# EasyEDA Pro project ProProject_Spherical_Robot_RC_V2.0_2024-05-04.epro

# Schematic Spherical_Robot_RC_V2.0

## Sheets
1 充电马达音频: Create Date: 2023-10-21; Page Name: 充电马达音频; Project Name: Spherical_Robot_RC_V2.0; Schematic Name: Spherical_Robot_RC_V2.0; Update Date: 2023-11-07; Company: 西安交通大学; Drawed: Daemon.Chen; Page Size: A4; Reviewed: Daemon.Chen; Version: V2.0
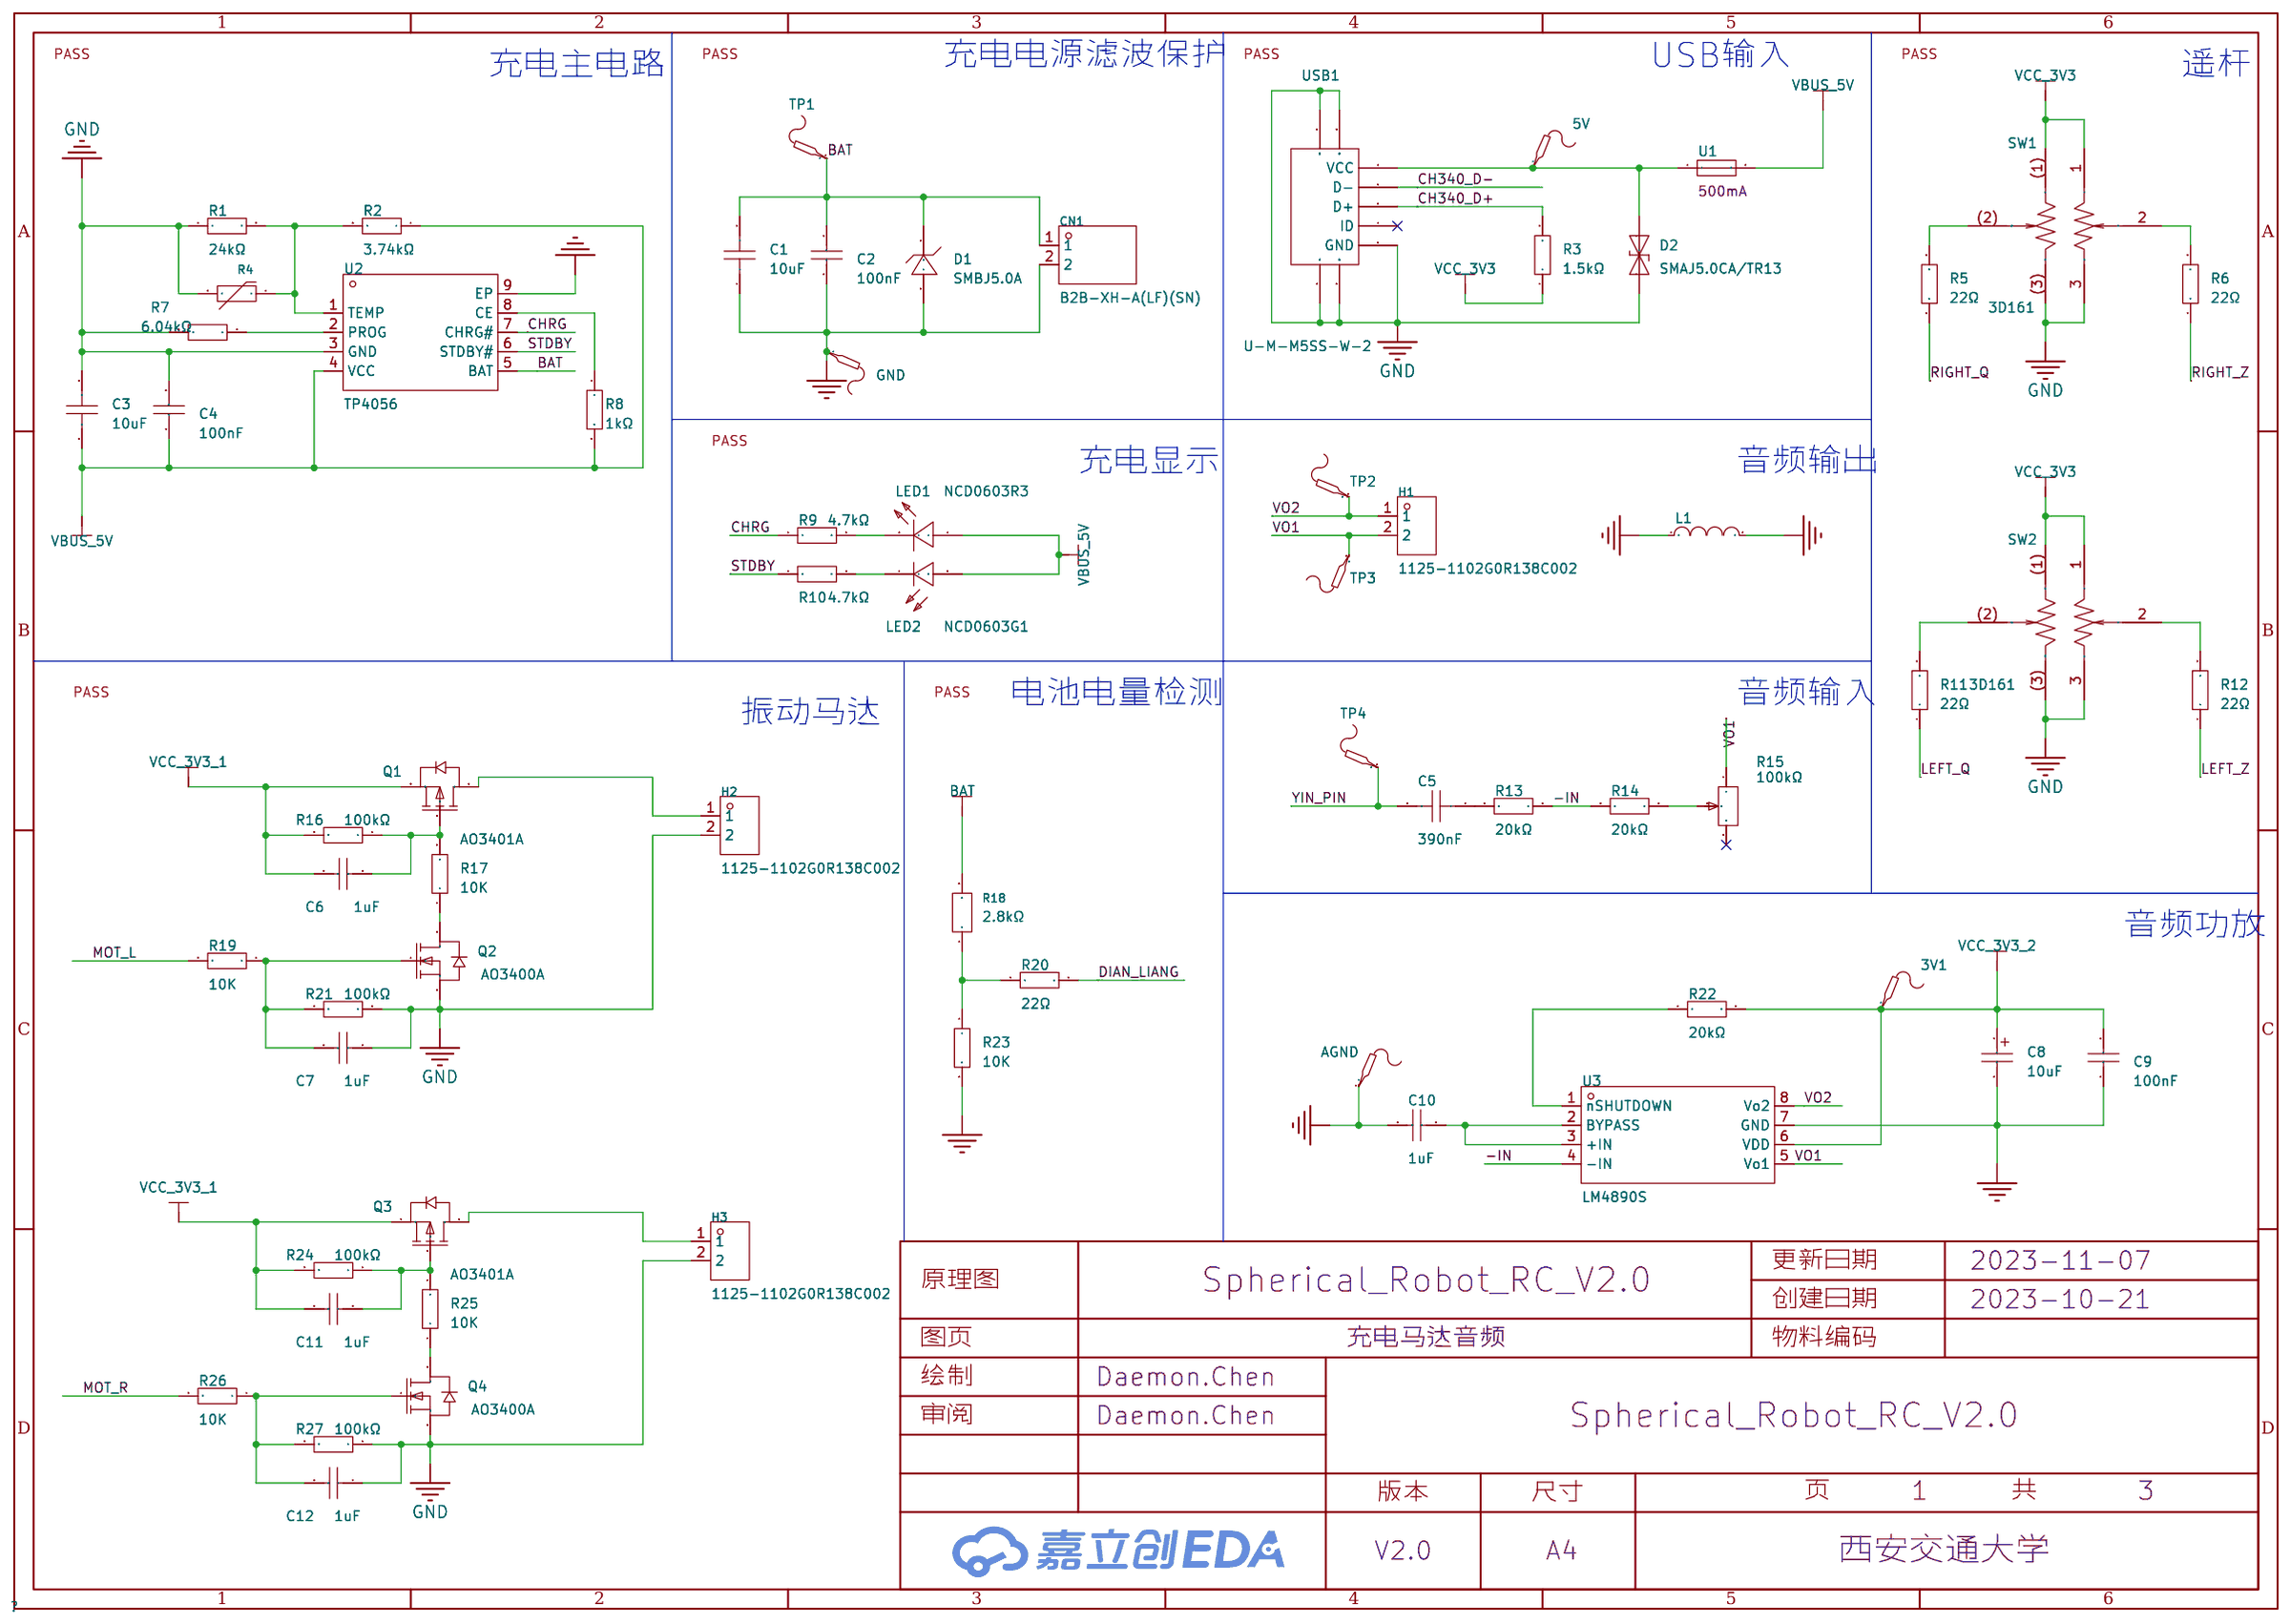
[diagram p0: 充电马达音频]
2 开关稳压: Page Name: 开关稳压; Schematic Name: Schematic1; Update Date: 2023-12-11
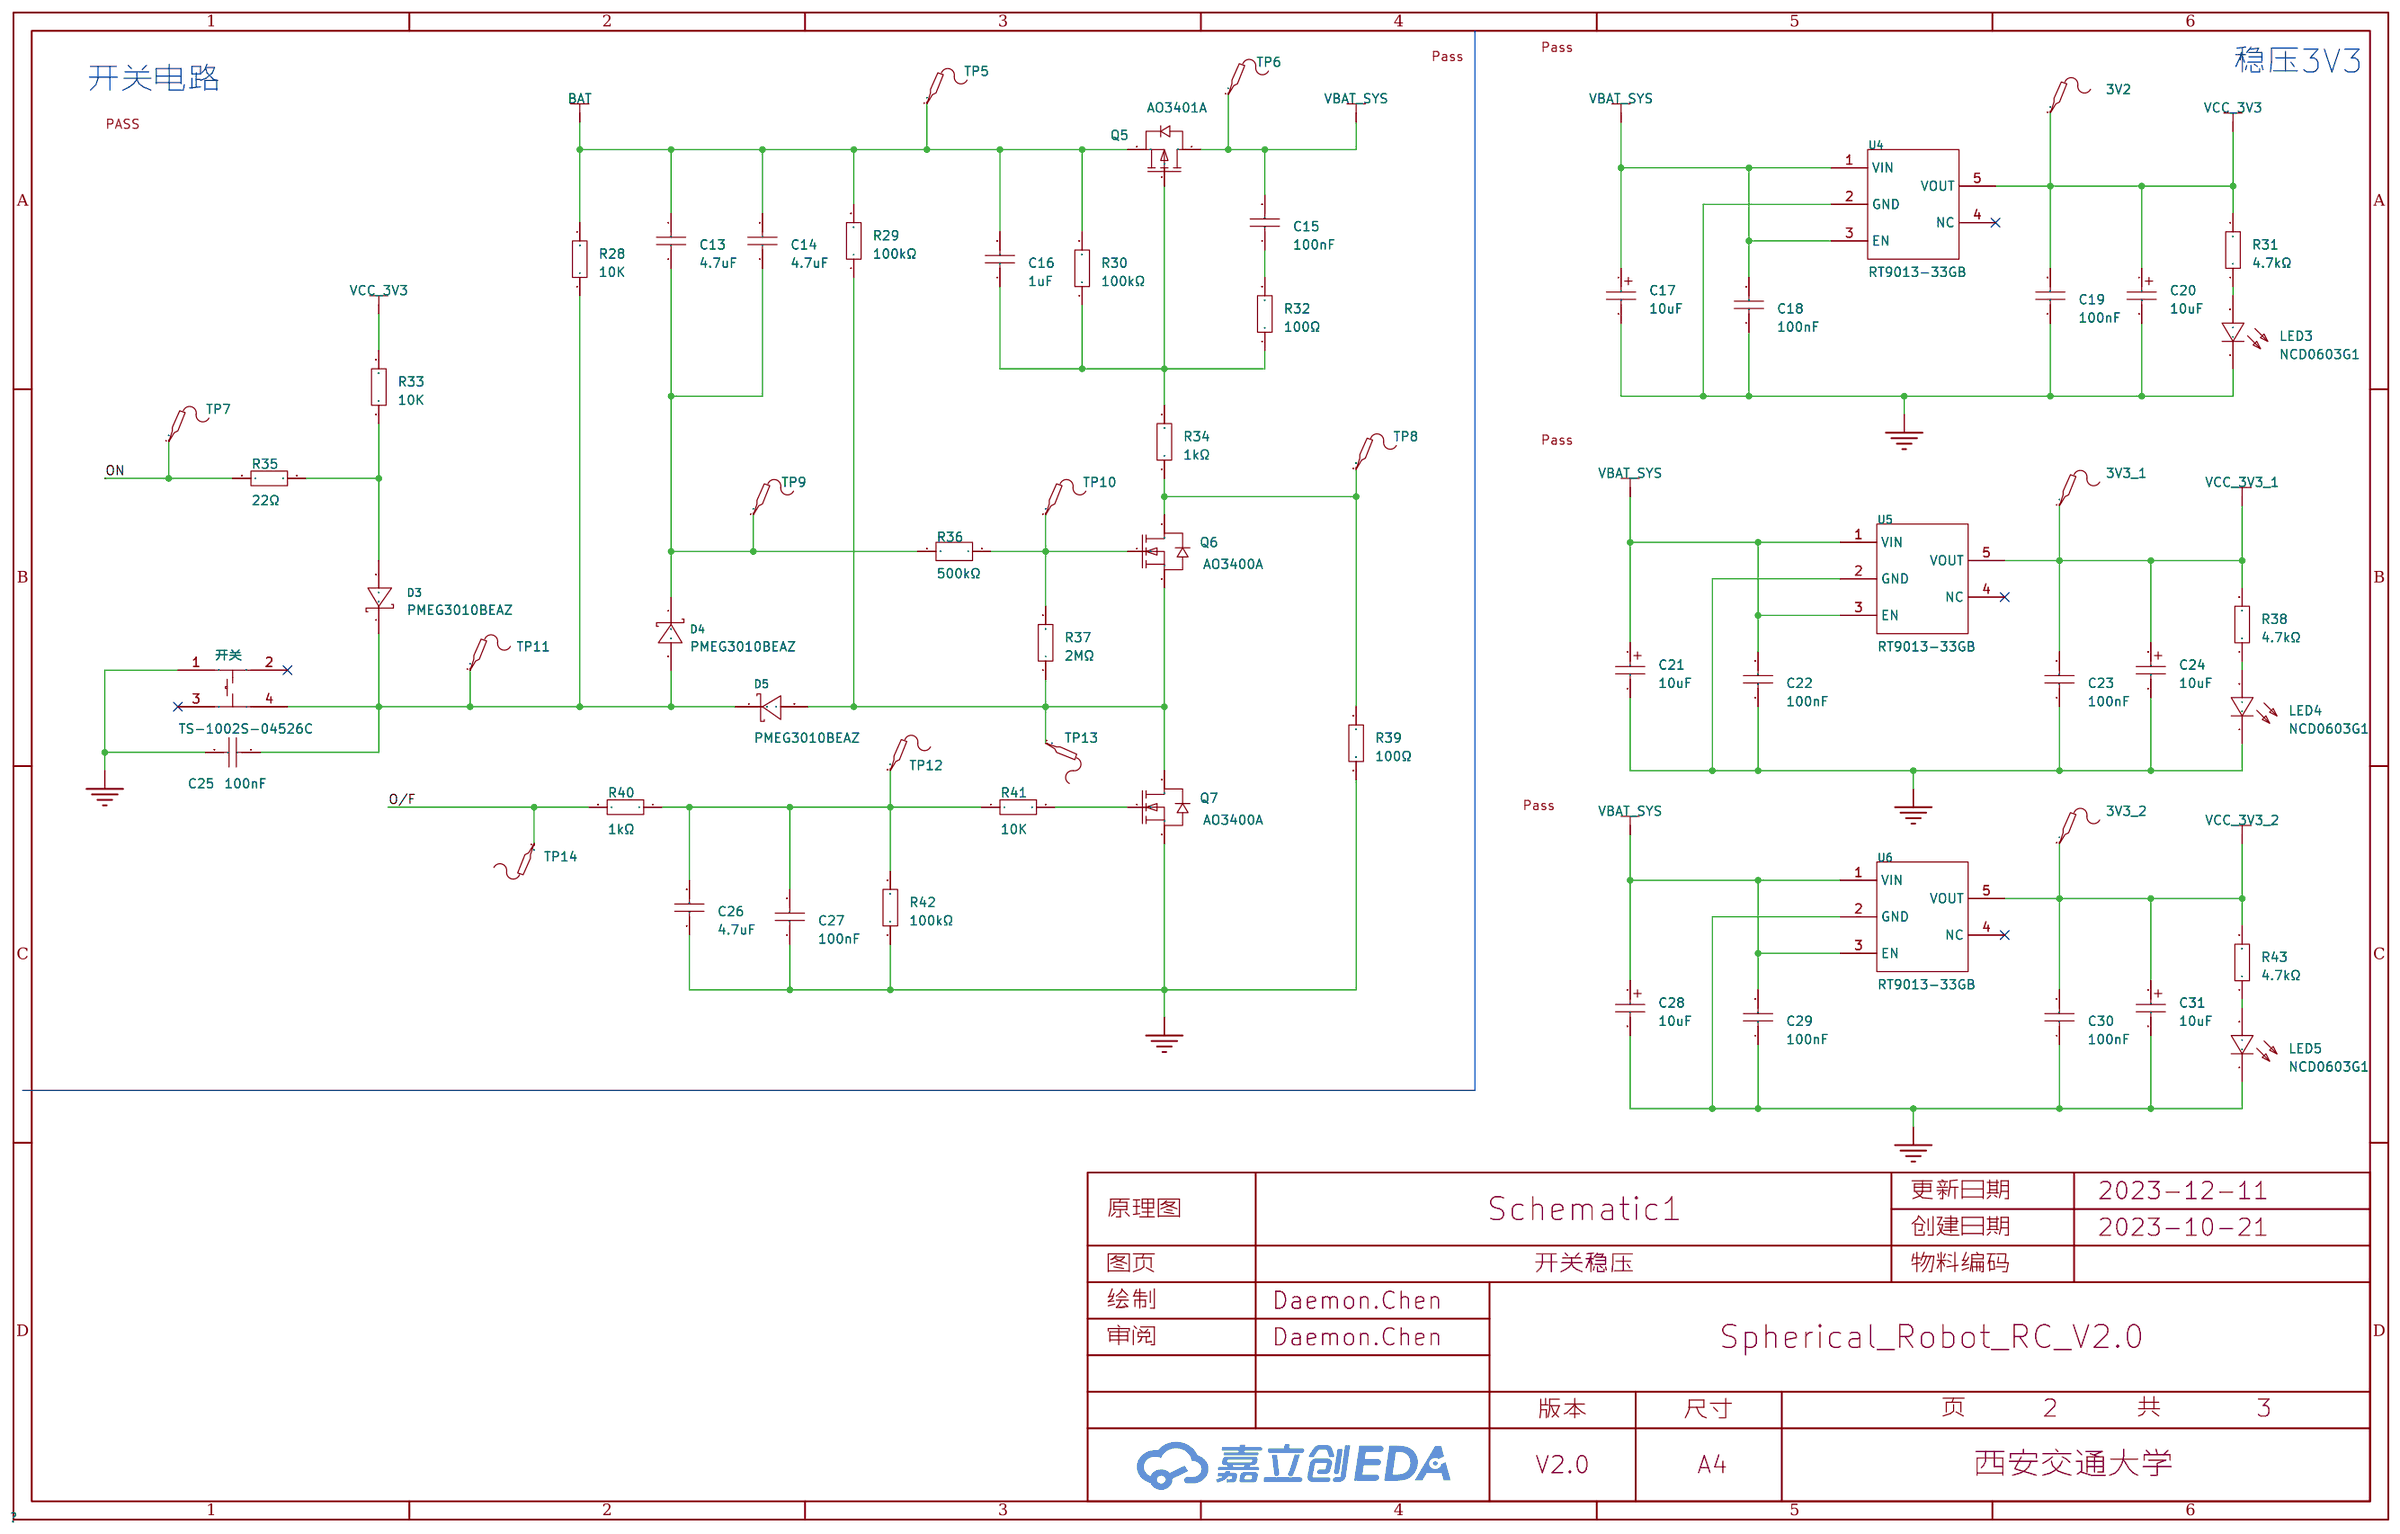
[diagram p1: 开关稳压]
3 芯片外设模块: Create Date: 2023-10-22; Page Name: 芯片外设模块; Schematic Name: Schematic1
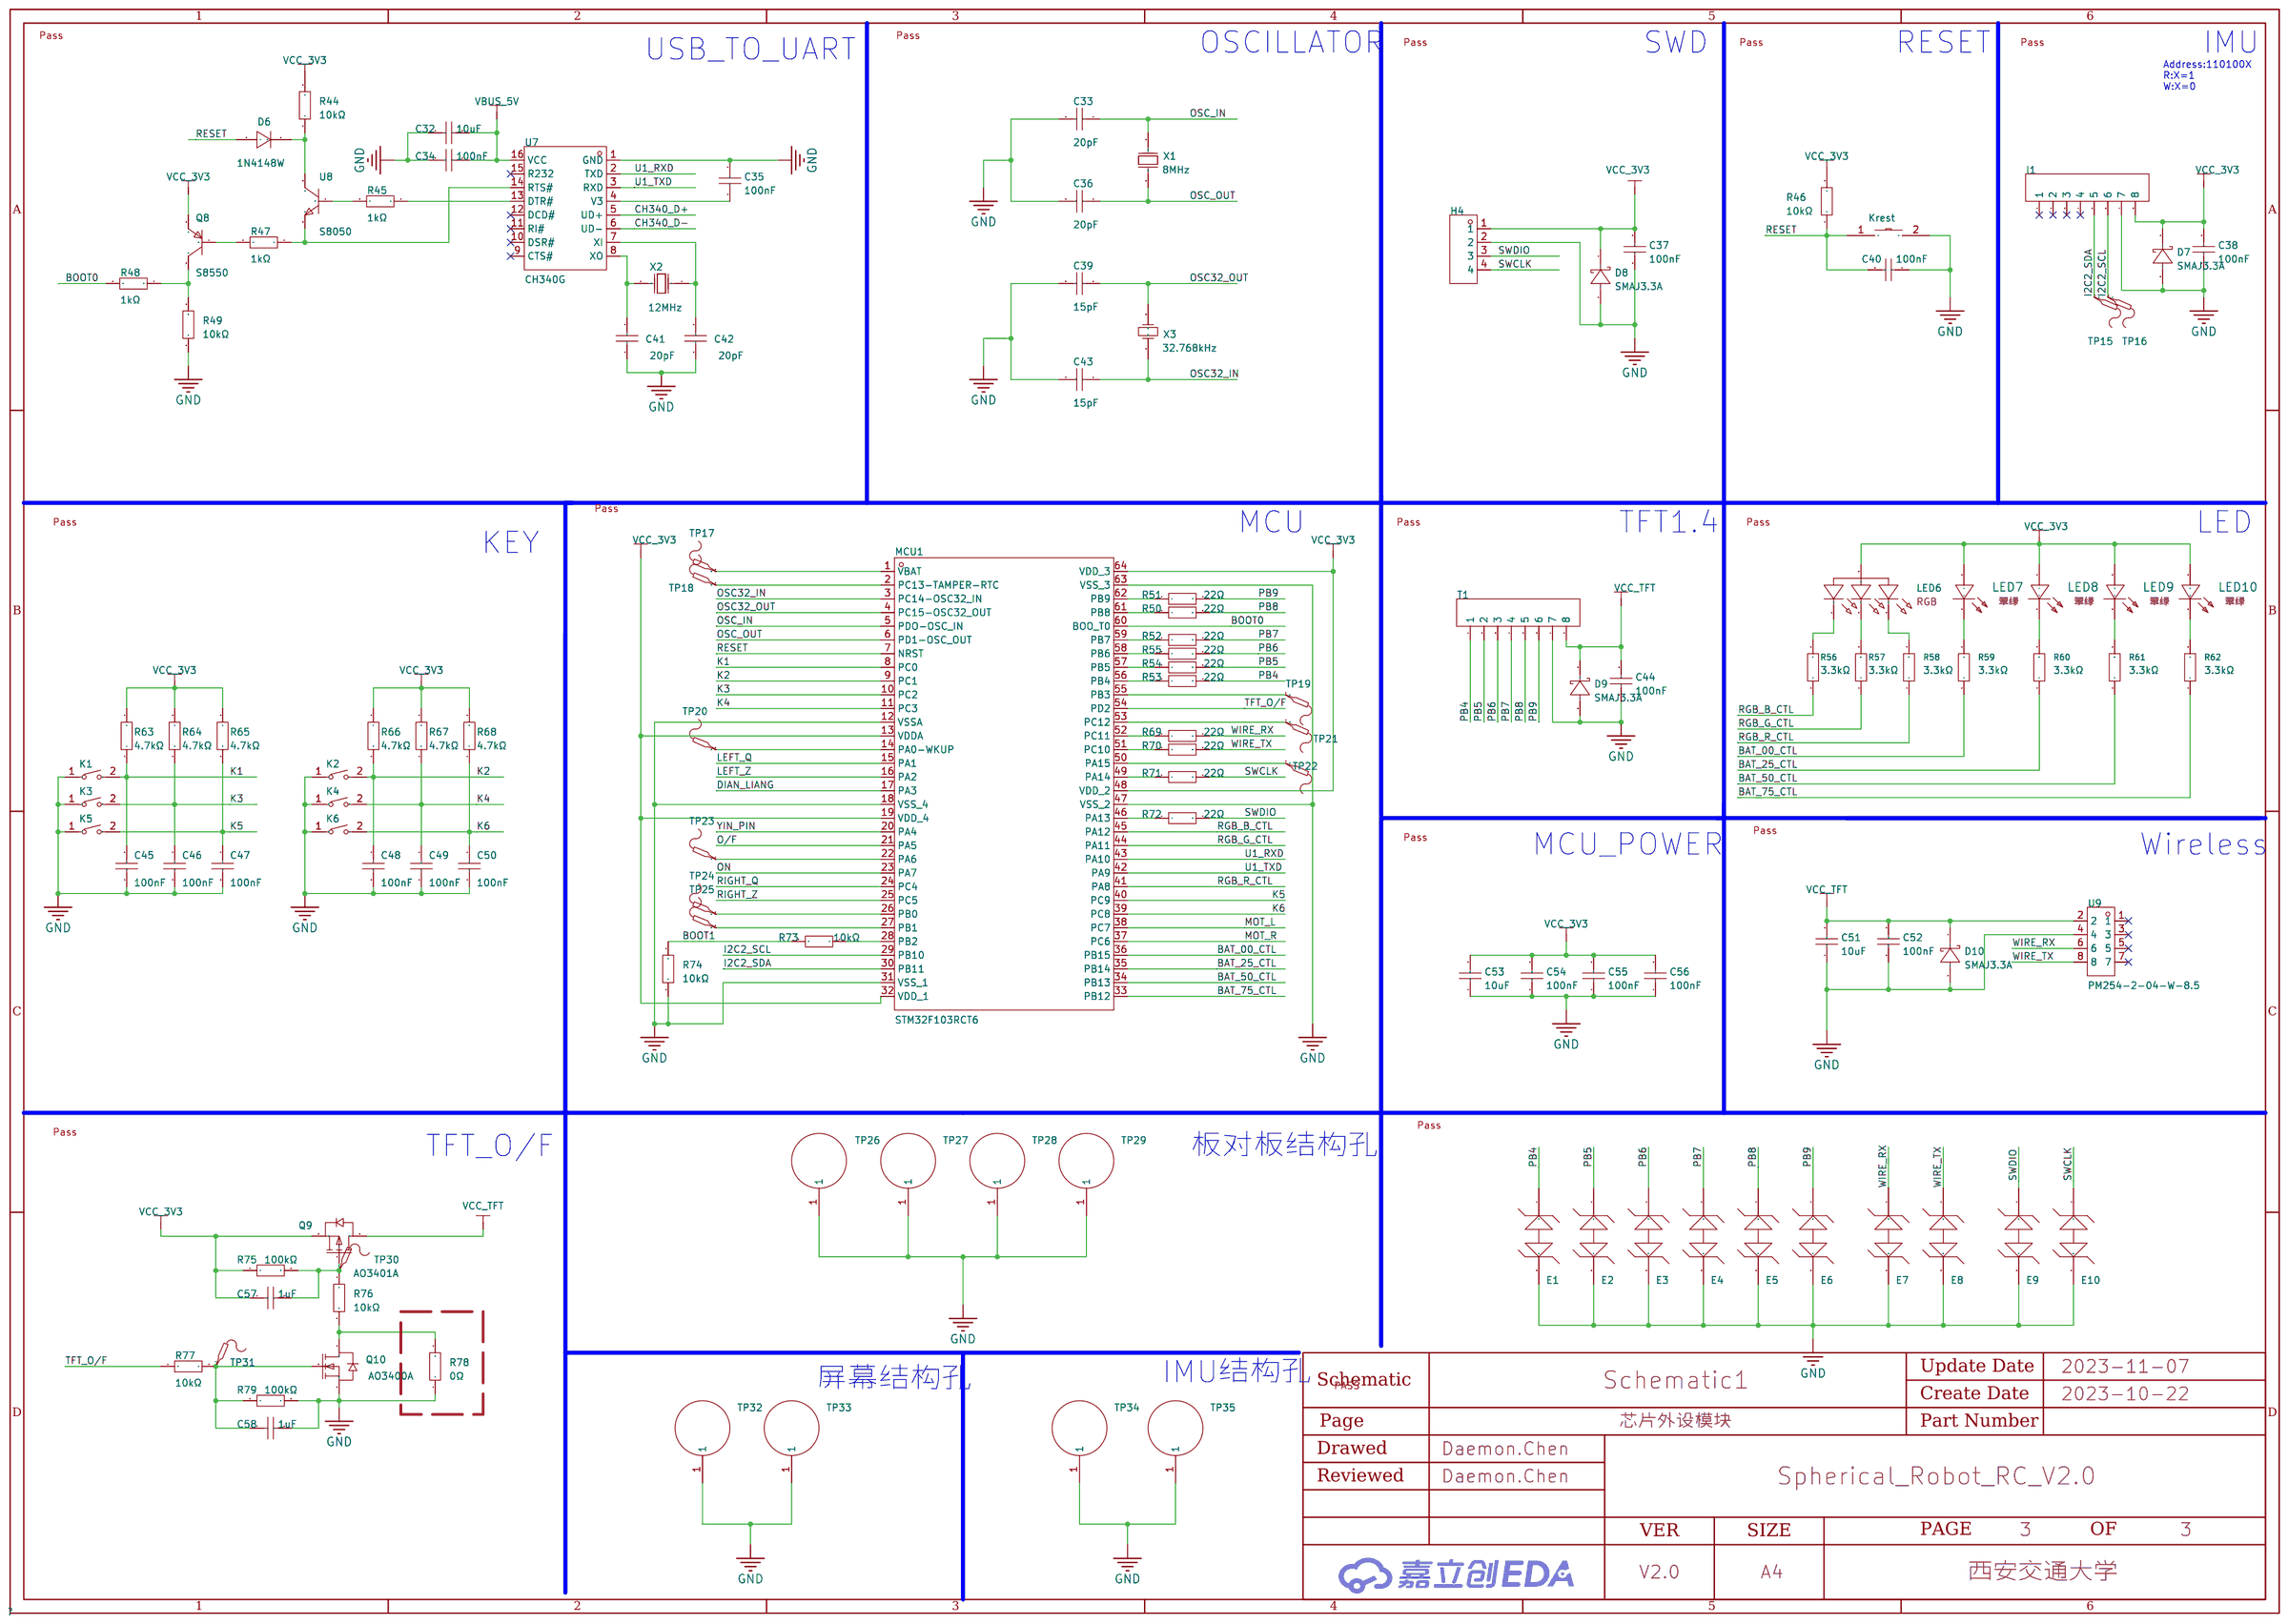
[diagram p2: 芯片外设模块]

## Parts
sheet 充电马达音频
3V1  -  [Test-Point-0.5mm]
5V  -  [Test-Point-0.5mm]
AGND  -  [Test-Point-0.5mm]
C1  10uF  [C0603]
C2  100nF  [C0603]
C3  10uF  [C0603]
C4  100nF  [C0603]
C5  390nF  [C0603]
C6  1uF  [C0603]
C7  1uF  [C0603]
C8  10uF  [CAP-SMD_L3.2-W1.6-RD]
C9  100nF  [C0603]
C10  1uF  [C0603]
C11  1uF  [C0603]
C12  1uF  [C0603]
CN1  B2B-XH-A(LF)(SN)  [CONN-TH_B2B-XH-A-LF-SN]
D1  SMBJ5.0A  [SMB_L4.4-W3.6-LS5.3-RD]
D2  SMAJ5.0CA/TR13  [SMA_L4.4-W2.6-LS5.0-BI]
GND  -  [Test-Point-0.5mm]
H1  1125-1102G0R138C002  [HDR-TH_2P-P2.54-H-M-W7.3]
H2  1125-1102G0R138C002  [HDR-TH_2P-P2.54-H-M-W7.3]
H3  1125-1102G0R138C002  [HDR-TH_2P-P2.54-H-M-W7.3]
L1  YI201209U121-5R0T  [L0805]
LED1  NCD0603R3  [LED0603-R-RD_RED]
LED2  NCD0603G1  [LED0603-RD]
Q1  AO3401A  [SOT-23-3_L2.9-W1.3-P1.90-LS2.4-BR]
Q2  AO3400A  [SOT-23-3_L2.9-W1.3-P1.90-LS2.4-BR]
Q3  AO3401A  [SOT-23-3_L2.9-W1.3-P1.90-LS2.4-BR]
Q4  AO3400A  [SOT-23-3_L2.9-W1.3-P1.90-LS2.4-BR]
R1  24kΩ  [R0603]
R2  3.74kΩ  [R0603]
R3  1.5kΩ  [R0603]
R4  NCP18XH103F03RB  [R0603]
R5  22Ω  [R0603]
R6  22Ω  [R0603]
R7  6.04kΩ  [R0603]
R8  1kΩ  [R0603]
R9  4.7kΩ  [R0603]
R10  4.7kΩ  [R0603]
R11  22Ω  [R0603]
R12  22Ω  [R0603]
R13  20kΩ  [R0603]
R14  20kΩ  [R0603]
R15  100kΩ  [RES-ADJ-TH_3296W]
R16  100kΩ  [R0603]
R17  10K  [R0603]
R18  2.8kΩ  [R0603]
R19  10K  [R0603]
R20  22Ω  [R0603]
R21  100kΩ  [R0603]
R22  20kΩ  [R0603]
R23  10K  [R0603]
R24  100kΩ  [R0603]
R25  10K  [R0603]
R26  10K  [R0603]
R27  100kΩ  [R0603]
SW1  3D161  [SW-TH_3D161]
SW2  3D161  [SW-TH_3D161]
TP1  -  [Test-Point-0.5mm]
TP2  -  [Test-Point-0.5mm]
TP3  -  [Test-Point-0.5mm]
TP4  -  [Test-Point-0.5mm]
U1  SMD0805B050TF  [F0805]
U2  TP4056  [ESOP-8_L4.9-W3.9-P1.27-LS6.0-BL-EP]
U3  LM4890S  [MSOP-8_L3.0-W3.0-P0.65-LS5.0-BL]
USB1  U-M-M5SS-W-2  [MICRO-USB-SMD_MICRO-USB-13]
sheet 开关稳压
3V2  -  [Test-Point-0.5mm]
3V3_1  -  [Test-Point-0.5mm]
3V3_2  -  [Test-Point-0.5mm]
C13  4.7uF  [C0603]
C14  4.7uF  [C0603]
C15  100nF  [C0603]
C16  1uF  [C0603]
C17  10uF  [CAP-SMD_L3.2-W1.6-RD]
C18  100nF  [C0603]
C19  100nF  [C0603]
C20  10uF  [CAP-SMD_L3.2-W1.6-RD]
C21  10uF  [CAP-SMD_L3.2-W1.6-RD]
C22  100nF  [C0603]
C23  100nF  [C0603]
C24  10uF  [CAP-SMD_L3.2-W1.6-RD]
C25  100nF  [C0603]
C26  4.7uF  [C0603]
C27  100nF  [C0603]
C28  10uF  [CAP-SMD_L3.2-W1.6-RD]
C29  100nF  [C0603]
C30  100nF  [C0603]
C31  10uF  [CAP-SMD_L3.2-W1.6-RD]
D3  PMEG3010BEAZ  [SOD-323_L1.8-W1.3-LS2.5-RD]
D4  PMEG3010BEAZ  [SOD-323_L1.8-W1.3-LS2.5-RD]
D5  PMEG3010BEAZ  [SOD-323_L1.8-W1.3-LS2.5-RD]
LED3  NCD0603G1  [LED0603-RD]
LED4  NCD0603G1  [LED0603-RD]
LED5  NCD0603G1  [LED0603-RD]
Q5  AO3401A  [SOT-23-3_L2.9-W1.3-P1.90-LS2.4-BR]
Q6  AO3400A  [SOT-23-3_L2.9-W1.3-P1.90-LS2.4-BR]
Q7  AO3400A  [SOT-23-3_L2.9-W1.3-P1.90-LS2.4-BR]
R28  10K  [R0603]
R29  100kΩ  [R0603]
R30  100kΩ  [R0603]
R31  4.7kΩ  [R0603]
R32  100Ω  [R0603]
R33  10K  [R0603]
R34  1kΩ  [R0603]
R35  22Ω  [R0603]
R36  500kΩ  [R0603]
R37  2MΩ  [R0603]
R38  4.7kΩ  [R0603]
R39  100Ω  [R0603]
R40  1kΩ  [R0603]
R41  10K  [R0603]
R42  100kΩ  [R0603]
R43  4.7kΩ  [R0603]
TP5  -  [Test-Point-0.5mm]
TP6  -  [Test-Point-0.5mm]
TP7  -  [Test-Point-0.5mm]
TP8  -  [Test-Point-0.5mm]
TP9  -  [Test-Point-0.5mm]
TP10  -  [Test-Point-0.5mm]
TP11  -  [Test-Point-0.5mm]
TP12  -  [Test-Point-0.5mm]
TP13  -  [Test-Point-0.5mm]
TP14  -  [Test-Point-0.5mm]
U4  RT9013-33GB  [SOT-23-5_L3.0-W1.7-P0.95-LS2.8-BL]
U5  RT9013-33GB  [SOT-23-5_L3.0-W1.7-P0.95-LS2.8-BL]
U6  RT9013-33GB  [SOT-23-5_L3.0-W1.7-P0.95-LS2.8-BL]
开关  TS-1002S-04526C  [SW-SMD_4P-L6.0-W6.0-P4.50-LS9.0-2]
sheet 芯片外设模块
C32  10uF  [C0603]
C33  20pF  [C0603]
C34  100nF  [C0603]
C35  100nF  [C0603]
C36  20pF  [C0603]
C37  100nF  [C0603]
C38  100nF  [C0603]
C39  15pF  [C0603]
C40  100nF  [C0603]
C41  20pF  [C0603]
C42  20pF  [C0603]
C43  15pF  [C0603]
C44  100nF  [C0603]
C45  100nF  [C0603]
C46  100nF  [C0603]
C47  100nF  [C0603]
C48  100nF  [C0603]
C49  100nF  [C0603]
C50  100nF  [C0603]
C51  10uF  [C0603]
C52  100nF  [C0603]
C53  10uF  [C0603]
C54  100nF  [C0603]
C55  100nF  [C0603]
C56  100nF  [C0603]
C57  1uF  [C0603]
C58  1uF  [C0603]
D6  1N4148W  [SOD-123_L2.8-W1.8-LS3.7-RD]
D7  SMAJ3.3A  [SMA_L4.3-W2.7-LS5.1-RD]
D8  SMAJ3.3A  [SMA_L4.3-W2.7-LS5.1-RD]
D9  SMAJ3.3A  [SMA_L4.3-W2.7-LS5.1-RD]
D10  SMAJ3.3A  [SMA_L4.3-W2.7-LS5.1-RD]
E1  CESDBLC5V0D3  [SOD-323_L1.8-W1.3-LS2.5-BI]
E2  CESDBLC5V0D3  [SOD-323_L1.8-W1.3-LS2.5-BI]
E3  CESDBLC5V0D3  [SOD-323_L1.8-W1.3-LS2.5-BI]
E4  CESDBLC5V0D3  [SOD-323_L1.8-W1.3-LS2.5-BI]
E5  CESDBLC5V0D3  [SOD-323_L1.8-W1.3-LS2.5-BI]
E6  CESDBLC5V0D3  [SOD-323_L1.8-W1.3-LS2.5-BI]
E7  CESDBLC5V0D3  [SOD-323_L1.8-W1.3-LS2.5-BI]
E8  CESDBLC5V0D3  [SOD-323_L1.8-W1.3-LS2.5-BI]
E9  CESDBLC5V0D3  [SOD-323_L1.8-W1.3-LS2.5-BI]
E10  CESDBLC5V0D3  [SOD-323_L1.8-W1.3-LS2.5-BI]
H4  2.54-1*4P反弯排针  [HDR-TH_4P-P2.54-H-M-W10.4]
I1  2.54-1*8P母环保  [HDR-TH_8P-P2.54-V-F-1]
K1  GT-TC060A-H025-L1  [SW-SMD_L6.1-W3.5-LS8.0]
K2  GT-TC060A-H025-L1  [SW-SMD_L6.1-W3.5-LS8.0]
K3  GT-TC060A-H025-L1  [SW-SMD_L6.1-W3.5-LS8.0]
K4  GT-TC060A-H025-L1  [SW-SMD_L6.1-W3.5-LS8.0]
K5  GT-TC060A-H025-L1  [SW-SMD_L6.1-W3.5-LS8.0]
K6  GT-TC060A-H025-L1  [SW-SMD_L6.1-W3.5-LS8.0]
Krest  TS-1101-C-W  [SW-SMD_L6.0-W3.3-LS8.0]
LED6  XL-2012RGBC  [LED-SMD_4P-L2.0-W1.3-BR]
LED7  NCD0805G1  [LED0805-R-RD]
LED8  NCD0805G1  [LED0805-R-RD]
LED9  NCD0805G1  [LED0805-R-RD]
LED10  NCD0805G1  [LED0805-R-RD]
MCU1  STM32F103RCT6  [LQFP-64_L10.0-W10.0-P0.50-LS12.0-BL]
Q8  S8550  [SOT-23-3_L2.9-W1.4-P1.90-LS2.6-BR]
Q9  AO3401A  [SOT-23-3_L2.9-W1.3-P1.90-LS2.4-BR]
Q10  AO3400A  [SOT-23-3_L2.9-W1.3-P1.90-LS2.4-BR]
R44  10kΩ  [R0603]
R45  1kΩ  [R0603]
R46  10kΩ  [R0603]
R47  1kΩ  [R0603]
R48  1kΩ  [R0603]
R49  10kΩ  [R0603]
R50  22Ω  [R0603]
R51  22Ω  [R0603]
R52  22Ω  [R0603]
R53  22Ω  [R0603]
R54  22Ω  [R0603]
R55  22Ω  [R0603]
R56  3.3kΩ  [R0603]
R57  3.3kΩ  [R0603]
R58  3.3kΩ  [R0603]
R59  3.3kΩ  [R0603]
R60  3.3kΩ  [R0603]
R61  3.3kΩ  [R0603]
R62  3.3kΩ  [R0603]
R63  4.7kΩ  [R0603]
R64  4.7kΩ  [R0603]
R65  4.7kΩ  [R0603]
R66  4.7kΩ  [R0603]
R67  4.7kΩ  [R0603]
R68  4.7kΩ  [R0603]
R69  22Ω  [R0603]
R70  22Ω  [R0603]
R71  22Ω  [R0603]
R72  22Ω  [R0603]
R73  10kΩ  [R0603]
R74  10kΩ  [R0603]
R75  100kΩ  [R0603]
R76  10kΩ  [R0603]
R77  10kΩ  [R0603]
R78  0Ω  [R0603]
R79  100kΩ  [R0603]
T1  2.54-1*8P母环保  [HDR-TH_8P-P2.54-V-F-1]
TP15  -  [Test-Point-0.5mm]
TP16  -  [Test-Point-0.5mm]
TP17  -  [Test-Point-0.5mm]
TP18  -  [Test-Point-0.5mm]
TP19  -  [Test-Point-0.5mm]
TP20  -  [Test-Point-0.5mm]
TP21  -  [Test-Point-0.5mm]
TP22  -  [Test-Point-0.5mm]
TP23  -  [Test-Point-0.5mm]
TP24  -  [Test-Point-0.5mm]
TP25  -  [Test-Point-0.5mm]
TP26  -  [螺丝孔]
TP27  -  [螺丝孔]
TP28  -  [螺丝孔]
TP29  -  [螺丝孔]
TP30  -  [Test-Point-0.5mm]
TP31  -  [Test-Point-0.5mm]
TP32  -  [螺丝孔]
TP33  -  [螺丝孔]
TP34  -  [螺丝孔]
TP35  -  [螺丝孔]
U7  CH340G  [SOIC-16_L9.9-W3.9-P1.27-LS6.0-BL]
U8  S8050  [SOT-23-3_L2.9-W1.3-P1.90-LS2.4]
U9  PM254-2-04-W-8.5  [HDR-TH_8P-P2.54-H-F-R2-C4-W8.5]
X1  8MHz  [CRYSTAL-SMD_L11.5-W4.8-LS12.7]
X2  12MHz  [HC-49S_L11.4-W4.8]
X3  32.768kHz  [OSC-TH_BD2.0-P0.70-D0.3]

## Library data of the parts
3V1 3V2 3V3_1 3V3_2 5V AGND GND TP1-TP25 TP30 TP31 = Test-Point: Test Point 测试点
C1 C3 = CL10A106KO8NQNC: 容值:10uF;精度:±10%;额定电压:16V;材质(温度系数):-;; LCSC Part Name: 10uF ±10% 16V; Supplier Part: C962136; Manufacturer: SAMSUNG(三星); Supplier Footprint: 0603; JLCPCB Part Class: Extended Part; Datasheet: https://atta.szlcsc.com/upload/public/pdf/source/20200102/C478861_C4302703595930F3C0E62DAD3349F1AA.pdf; Supplier: LCSC; Tolerance: ±10%; Voltage Rated: 16V
C2 C4 C9 C15 C18 C19 C22 C23 C25 C27 C29 C30 C34 C35 C37 C38 C40 C44-C50 C52 C54-C56 = CL10B104KO8NNNC: 容值:100nF;精度:±10%;额定电压:16V;材质(温度系数):X7R;; LCSC Part Name: 100nF ±10% 16V; Supplier Part: C66501; Manufacturer: SAMSUNG(三星); Supplier Footprint: 0603; JLCPCB Part Class: Extended Part; Datasheet: https://atta.szlcsc.com/upload/public/pdf/source/20160218/1457707763339.pdf; Supplier: LCSC; Tolerance: ±10%; Voltage Rated: 16V; Temperature Coefficient: X7R
C5 = GCM188R71C394KA55D: 容值:390nF;精度:±10%;额定电压:16V;材质(温度系数):X7R;; LCSC Part Name: 390nF ±10% 16V; Supplier Part: C437460; Manufacturer: muRata(村田); Supplier Footprint: 0603; JLCPCB Part Class: Extended Part; Datasheet: https://atta.szlcsc.com/upload/public/pdf/source/20191016/C437460_4778CED9EF711AA133065768C7706B4D.pdf; Supplier: LCSC; Tolerance: ±10%; Voltage Rated: 16V; Temperature Coefficient: X7R
C6 C7 C10-C12 C16 = CL10A105KO8NNNC: 容值:1uF;精度:±10%;额定电压:16V;材质(温度系数):X5R;; LCSC Part Name: 1uF ±10% 16V; Supplier Part: C1592; Manufacturer: SAMSUNG(三星); Supplier Footprint: 0603; JLCPCB Part Class: 扩展库; Datasheet: https://atta.szlcsc.com/upload/public/pdf/source/20220919/9FBE606BE0D9532D730F292EB26DC5BB.pdf; Supplier: LCSC; Tolerance: ±10%; Voltage Rated: 16V; Temperature Coefficient: X5R
C8 C17 C20 C21 C24 C28 C31 = CA45-A-16V-10uF-K: 容值:10uF;精度:±10%;额定电压:16V;等效串联电阻:10Ω@100kHz;; LCSC Part Name: 10uF ±10% 16V; Supplier Part: C128254; Manufacturer: CEC(振华新云); Supplier Footprint: CASE-A-3216; JLCPCB Part Class: 扩展库; Datasheet: https://atta.szlcsc.com/upload/public/pdf/source/20170914/C128254_1505359752472967905.pdf; Supplier: LCSC; Tolerance: ±10%; Rated Voltage: 16V; Equivalent Series Resistance(ESR): 10Ω@100kHz; Operating Temperature: -55℃~+125℃
CN1 = B2B-XH-A(LF)(SN): 参考系列:XH;间距:2.5mm;插针结构:1x2P;排数:1;每排PIN数:2;行距:-;安装方式:-;触头材质:黄铜;; LCSC Part Name: XH 2.5mm 1x2P; Supplier Part: C158012; Manufacturer: JST; Supplier Footprint: 插件,P=2.5mm; JLCPCB Part Class: 扩展库; Supplier: LCSC; Reference Series: XH; Pitch: 2.5mm; Pins Structure: 1x2P; Number of Rows: 1; Number of PINs Per Row: 2; Contact Material: 黄铜
D1 = SMBJ5.0A_C726811: 极性:单向;; LCSC Part Name: 单向; Supplier Part: C726811; Manufacturer: TWGMC(台湾迪嘉); Supplier Footprint: SMB; JLCPCB Part Class: 扩展库; Datasheet: https://atta.szlcsc.com/upload/public/pdf/source/20200901/C726811_07201DC3516E92FF13903A0BAE18F725.pdf; Supplier: LCSC; Polarity: 单向
D2 = SMAJ5.0CA/TR13: 极性:双向;反向截止电压(Vrwm):5V;击穿电压(最小值):6.4V;击穿电压(最大值):7V;反向漏电流(Ir):800uA;峰值脉冲电流(Ipp)@10/1000s:43.5A;最大钳位电压:9.2V;; LCSC Part Name: 双向 Vrwm:5V; Supplier Part: C78402; Manufacturer: Brightking(君耀电子); Supplier Footprint: SMA(DO-214AC); JLCPCB Part Class: Extended Part; Datasheet: https://atta.szlcsc.com/upload/public/pdf/source/20160709/1468031881739.pdf; Supplier: LCSC; Polarity: 双向; Reverse Stand-Off Voltage (Vrwm): 5V; Breakdown Voltage (Min): 6.4V; Breakdown Voltage (Max): 7V; Reverse Leakage Current (Ir): 800uA; Peak Pulse Current (Ipp)@10/1000μs: 43.5A; Maximum Clamping Voltage: 9.2V
H1-H3 = 1125-1102G0R138C002: 间距:2.54mm;总PIN位数:2;排数:1;插针结构:1x2P;行距:2.54mm;安装类型:弯插;圆针/方针:方针;额定电流:3A;额定电压:320V;配合针长度:3mm;塑高:2.5mm;端接针长度:-;触头材质:黄铜;触头镀层:金;工作温度范围:-40℃~+105℃;颜色:黑色;; LCSC Part Name: 2.54mm 1x2P 弯插 方针; Supplier Part: C721441; Manufacturer: Wcon(维峰电子); Supplier Footprint: 插件,P=2.54mm; JLCPCB Part Class: 扩展库; Supplier: LCSC; Pitch: 2.54mm; Number of Pins: 2; Number of Rows: 1; Pin Structure: 1x2P; Row Spacing: 2.54mm; Mounting Type: 弯插; Circluar Pins/Square Pins: 方针; Current Rating (Max): 3A; Voltage Rating (Max): 320V; Length of Mating Pin: 3mm; Insulation Height: 2.5mm; Contact Material: 黄铜; Contact Plating: 金; Operating Temperature Range: -40℃~+105℃; Color: 黑色
L1 = YI201209U121-5R0T: 标称阻抗@测试频率:120Ω@100MHz;误差:±25%;直流电阻(RDC):30mΩ;额定电流:5A;; LCSC Part Name: 120Ω@100MHz ±25%; Supplier Part: C2971889; Manufacturer: YJYCOIN(益嘉源); Supplier Footprint: 0805; JLCPCB Part Class: Extended Part; Datasheet: https://atta.szlcsc.com/upload/public/pdf/source/20220124/0B82DFBCB0ECDB082B32D6E52BFF1CFB.pdf; Supplier: LCSC; Impedance @ Frequency: 120Ω@100MHz; Tolerance: ±25%; DC Resistance: 30mΩ; Current Rating: 5A
LED1 = NCD0603R3: 尺寸1.6x0.8x0.8；IF=20ma：1.6~2.6v，620~640nm,51~150mcd金线，光强高，功耗低，可靠性好，寿命长; LCSC Part Name: 红色;贴片LED;0603红灯;; Supplier Part: C3151730; Manufacturer: 国星光电; Supplier Footprint: 0603; JLCPCB Part Class: 扩展库; Datasheet: https://atta.szlcsc.com/upload/public/pdf/source/20220704/CBFF28C1847A97213A75929E60B7DDE7.pdf; Supplier: LCSC
LED2-LED5 = NCD0603G1: 发光颜色:翠绿;; LCSC Part Name: 翠绿; Supplier Part: C84267; Manufacturer: 国星光电; Supplier Footprint: 0603; JLCPCB Part Class: 扩展库; Datasheet: https://atta.szlcsc.com/upload/public/pdf/source/20200820/C84267_04BA7703640BAC111D09F5EFB971FBF3.pdf; Supplier: LCSC; Emitted Color: 翠绿
Q1 Q3 Q5 Q9 = AO3401A_C700954: 漏源电压（Vdss）:-30V;连续漏极电流（Id）（25°C 时）:4.2A;栅源极阈值电压:1.5V @ 250uA;漏源导通电阻:65mΩ @ 3A,10V;最大功率耗散（Ta=25°C）:1W;类型:P沟道;; Supplier Part: C700954; Manufacturer: HUASHUO(华朔); Supplier Footprint: SOT-23; JLCPCB Part Class: Extended Part; Datasheet: https://atta.szlcsc.com/upload/public/pdf/source/20200713/C700954_50D0EF28D145CDC0B45B48010B096AD0.pdf; Supplier: LCSC
Q2 Q4 Q6 Q7 Q10 = AO3400A: 类型:N沟道;漏源电压(Vdss):30V;连续漏极电流(Id):5.2A;功率(Pd):1W;导通电阻(RDS(on)@Vgs,Id):35mΩ@10V,5A;阈值电压(Vgs(th)@Id):1.5V@250A;; LCSC Part Name: N沟道 30V 5.2A; Supplier Part: C700953; Manufacturer: HUASHUO(华朔); Supplier Footprint: SOT-23; JLCPCB Part Class: Extended Part; Datasheet: https://atta.szlcsc.com/upload/public/pdf/source/20200713/C700953_2C399A25E2B0CA38CA8BE1B404780CC1.pdf; Supplier: LCSC; Type: N沟道; Drain Source Voltage (Vdss): 30V; Continuous Drain Current (Id): 5.2A; Power Dissipation (Pd): 1W; Drain Source On Resistance (RDS(on)@Vgs,Id): 35mΩ@10V,5A; Gate Threshold Voltage (Vgs(th)@Id): 1.5V@250A
R1 = 0603WAF2402T5E: 电阻类型:厚膜电阻;阻值:24kΩ;精度:±1%;功率:100mW;; LCSC Part Name: 24kΩ ±1% 100mW; Supplier Part: C23352; Manufacturer: UNI-ROYAL(厚声); Supplier Footprint: 0603; JLCPCB Part Class: Basic Part; Datasheet: https://atta.szlcsc.com/upload/public/pdf/source/20200306/C422600_1E6D84923E4A46A82E41ADD87F860B5C.pdf; Supplier: LCSC; Type: 厚膜电阻; Tolerance: ±1%; Power(Watts): 100mW; Temperature Coefficient: ±100ppm/℃; Overload Voltage (Max): 75V; Operating Temperature Range: -55℃~+155℃
R2 = RTT033741FTP: 电阻类型:厚膜电阻;阻值:3.74kΩ;精度:±1%;功率:100mW;; LCSC Part Name: 3.74kΩ ±1% 100mW; Supplier Part: C103587; Manufacturer: RALEC(旺诠); Supplier Footprint: 0603; JLCPCB Part Class: Extended Part; Datasheet: https://atta.szlcsc.com/upload/public/pdf/source/20170408/1491646257078.pdf; Supplier: LCSC; Type: 厚膜电阻; Tolerance: ±1%; Power(Watts): 100mW; Temperature Coefficient: ±100ppm/℃; Overload Voltage (Max): 75V; Operating Temperature Range: -55℃~+155℃
R3 = 0603WAF1501T5E: 阻值:1.5kΩ;精度:±1%;温度系数:±100ppm/℃;功率:1/10W;最大工作电压:75V;工作温度范围:-55℃~+155℃;; LCSC Part Name: 1.5KΩ ±1%; Supplier Part: C22843; Manufacturer: UNI-ROYAL(厚声); Supplier Footprint: 0603; JLCPCB Part Class: Basic Part; Datasheet: https://atta.szlcsc.com/upload/public/pdf/source/20170920/C22843_1505887489783980640.pdf; Supplier: LCSC; Tolerance: ±1%; Temperature Coefficient: ±100ppm/℃; Power(Watts): 1/10W; Overload Voltage (Max): 75V; Operating Temperature Range: -55℃~+155℃
R4 = NCP18XH103F03RB: 阻值(25℃):10kΩ;电阻精度:±1%;B值精度:±1%;B值(25℃/50℃):3380K;功率:100mW;最大稳态电流(25℃):310uA;B值(25℃/75℃):-;B值(25℃/85℃):3334K;B值(25℃/100℃):3455K;工作温度:-40℃~+125℃;; LCSC Part Name: 10kΩ 电阻精度:±1% 3380K; Supplier Part: C13564; Manufacturer: muRata(村田); Supplier Footprint: 0603; JLCPCB Part Class: 扩展库; Supplier: LCSC; Resistance @ 25℃: 10kΩ; Resistance Tolerance: ±1%; B Constant Tolerance: ±1%; B Constant (25℃/50℃): 3380K; Power: 100mW; Steady State Current (Max): 310uA; B Constant (25℃/85℃): 3334K; B Constant (25℃/100℃): 3455K; Operating Temperature: -40℃~+125℃
R5 R6 R11 R12 R20 R35 = 0603WAF220JT5E: 电阻类型:厚膜电阻;阻值:22Ω;精度:±1%;功率:100mW;; LCSC Part Name: 22Ω ±1% 100mW; Supplier Part: C23345; Manufacturer: UNI-ROYAL(厚声); Supplier Footprint: 0603; JLCPCB Part Class: Basic Part; Datasheet: https://atta.szlcsc.com/upload/public/pdf/source/20200306/C422600_1E6D84923E4A46A82E41ADD87F860B5C.pdf; Supplier: LCSC; Type: 厚膜电阻; Tolerance: ±1%; Power(Watts): 100mW; Temperature Coefficient: ±100ppm/℃; Overload Voltage (Max): 75V; Operating Temperature Range: -55℃~+155℃
R7 = RMC06036.04K1%N: 阻值:6.04kΩ;精度:±1%;功率:100mW;; LCSC Part Name: 6.04kΩ ±1% 100mW; Supplier Part: C325745; Manufacturer: Tyohm(幸亚电阻); Supplier Footprint: 0603; JLCPCB Part Class: Extended Part; Datasheet: https://atta.szlcsc.com/upload/public/pdf/source/20190115/C325745_6A8F15ACFA51644C0A494B4F3DD07D16.pdf; Supplier: LCSC; Tolerance: ±1%; Power(Watts): 100mW
R8 = 0603WAF1001T5E: 电阻类型:厚膜电阻;阻值:1kΩ;精度:±1%;功率:100mW;; LCSC Part Name: 1kΩ ±1% 100mW; Supplier Part: C21190; Manufacturer: UNI-ROYAL(厚声); Supplier Footprint: 0603; JLCPCB Part Class: Basic Part; Datasheet: https://atta.szlcsc.com/upload/public/pdf/source/20200306/C422600_1E6D84923E4A46A82E41ADD87F860B5C.pdf; Supplier: LCSC; Type: 厚膜电阻; Tolerance: ±1%; Power(Watts): 100mW; Temperature Coefficient: ±100ppm/℃; Overload Voltage (Max): 75V; Operating Temperature Range: -55℃~+155℃
R9 R10 R31 R38 R43 = 0603WAF4701T5E: 电阻类型:厚膜电阻;阻值:4.7kΩ;精度:±1%;功率:100mW;; LCSC Part Name: 4.7kΩ ±1% 100mW; Supplier Part: C23162; Manufacturer: UNI-ROYAL(厚声); Supplier Footprint: 0603; JLCPCB Part Class: Basic Part; Datasheet: https://atta.szlcsc.com/upload/public/pdf/source/20200306/C422600_1E6D84923E4A46A82E41ADD87F860B5C.pdf; Supplier: LCSC; Type: 厚膜电阻; Tolerance: ±1%; Power(Watts): 100mW; Temperature Coefficient: ±100ppm/℃; Overload Voltage (Max): 75V; Operating Temperature Range: -55℃~+155℃
R13 R14 R22 = 0603WAF2002T5E: 电阻类型:厚膜电阻;阻值:20kΩ;精度:±1%;功率:100mW;; LCSC Part Name: 20kΩ ±1% 100mW; Supplier Part: C4184; Manufacturer: UNI-ROYAL(厚声); Supplier Footprint: 0603; JLCPCB Part Class: Basic Part; Datasheet: https://atta.szlcsc.com/upload/public/pdf/source/20200306/C422600_1E6D84923E4A46A82E41ADD87F860B5C.pdf; Supplier: LCSC; Type: 厚膜电阻; Tolerance: ±1%; Power(Watts): 100mW; Temperature Coefficient: ±100ppm/℃; Overload Voltage (Max): 75V; Operating Temperature Range: -55℃~+155℃
R15 = 3296W-1-104LF: 阻值:100kΩ;精度:±10%;; LCSC Part Name: 100kΩ ±10%; Supplier Part: C48084; Manufacturer: BOURNS; Supplier Footprint: 插件; JLCPCB Part Class: 扩展库; Datasheet: https://atta.szlcsc.com/upload/public/pdf/source/20150811/1457707339453.pdf; Supplier: LCSC; Tolerance: ±10%
R16 R21 R24 R27 R29 R30 R42 = 0603WAF1003T5E: 电阻类型:厚膜电阻;阻值:100kΩ;精度:±1%;功率:100mW;; LCSC Part Name: 100kΩ ±1% 100mW; Supplier Part: C25803; Manufacturer: UNI-ROYAL(厚声); Supplier Footprint: 0603; JLCPCB Part Class: Basic Part; Datasheet: https://atta.szlcsc.com/upload/public/pdf/source/20200306/C422600_1E6D84923E4A46A82E41ADD87F860B5C.pdf; Supplier: LCSC; Type: 厚膜电阻; Tolerance: ±1%; Power(Watts): 100mW; Temperature Coefficient: ±100ppm/℃; Overload Voltage (Max): 75V; Operating Temperature Range: -55℃~+155℃
R17 R19 R23 R25 R26 R28 R33 R41 = Res_0603: Supplier Footprint: 0603
R18 = FRC0603F2801TS: 电阻类型:厚膜电阻;阻值:2.8kΩ;精度:±1%;功率:100mW;温度系数:±100ppm/℃;; LCSC Part Name: 厚膜电阻 2.8kΩ ±1% 100mW; Supplier Part: C2933188; Manufacturer: FOJAN(富捷); Supplier Footprint: 0603; JLCPCB Part Class: Extended Part; Datasheet: https://atta.szlcsc.com/upload/public/pdf/source/20220106/419F9A744E028BDEAB962DB585E9ADC2.pdf; Supplier: LCSC; Type: 厚膜电阻; Tolerance: ±1%; Power(Watts): 100mW; Temperature Coefficient: ±100ppm/℃; Overload Voltage (Max): 50V; Operating Temperature Range: -55℃~+155℃
SW1 SW2 = 3D161: 摇杆  多向; LCSC Part Name: 3D161  3D摇杆 自恢复; Supplier Part: C92593; Manufacturer: 韩国韩荣; Supplier Footprint: 插件,16x16mm; JLCPCB Part Class: 扩展库; Datasheet: https://atta.szlcsc.com/upload/public/pdf/source/20170523/1495534045704.pdf; Supplier: LCSC
U1 = SMD0805B050TF: 最大电压:6V;最大电流:100A;保持电流:500mA;跳闸电流:1A;最大动作时间:100ms;; LCSC Part Name: 6V 0.5A; Supplier Part: C269104; Manufacturer: Brightking(君耀电子); Supplier Footprint: 0805; JLCPCB Part Class: Extended Part; Datasheet: https://atta.szlcsc.com/upload/public/pdf/source/20180814/C269104_466839A5DB65F6E723CA6A162ACE747B.pdf; Supplier: LCSC; Operating Voltage (Max): 6V; Current Rating (Max): 100A; Hold Current: 500mA; Trip Current: 1A; Maximum Time to Trip: 100ms
U2 = TP4056_C725790: Supplier Part: C725790; Manufacturer: UMW(友台半导体); Supplier Footprint: ESOP-8; JLCPCB Part Class: 扩展库; Datasheet: https://atta.szlcsc.com/upload/public/pdf/source/20211011/37515E71BA298E23D23475482C49633D.pdf; Supplier: LCSC
U3 = LM4890S_C329452: 功放类型:-;输出功率:-;; Supplier Part: C329452; Manufacturer: IDCHIP(英锐芯); Supplier Footprint: MSOP-8; JLCPCB Part Class: Extended Part; Datasheet: https://atta.szlcsc.com/upload/public/pdf/source/20190121/C329452_9DA1BC198EDF4C12DB2B5C9529AAE98C.pdf; Supplier: LCSC
USB1 = U-M-M5SS-W-2: 连接器类型:Mini-B;标准:USB 2;公母:母座;触点数量:5;端口数量:1;; LCSC Part Name: MINI USB 5P  7.5mm*9.2mm; Supplier Part: C91144; Manufacturer: 韩国韩荣; Supplier Footprint: SMD; JLCPCB Part Class: Extended Part; Datasheet: https://atta.szlcsc.com/upload/public/pdf/source/20190321/C91144_D01C1B7365E253C6D724F0A729540DF2.pdf; Supplier: LCSC; Connector Type: Mini-B; Standard: USB 2; Gender: 母座; Number of Contacts: 5; Number of Ports: 1
C13 C14 C26 = CL10A475KO8NNNC: 容值:4.7uF;精度:±10%;额定电压:16V;材质(温度系数):X5R;; LCSC Part Name: 4.7uF ±10% 16V; Supplier Part: C19666; Manufacturer: SAMSUNG(三星); Supplier Footprint: 0603; JLCPCB Part Class: 基础库; Datasheet: https://atta.szlcsc.com/upload/public/pdf/source/20160103/1457707703134.pdf; Supplier: LCSC; Tolerance: ±10%; Voltage Rated: 16V; Temperature Coefficient: X5R
D3-D5 = PMEG3010BEAZ: 直流反向耐压(Vr):30V;平均整流电流(Io):1A;正向压降(Vf):560mV@1A;; LCSC Part Name: 电压:30V 电流:1A; Supplier Part: C552858; Manufacturer: Nexperia(安世); Supplier Footprint: SOD-323; JLCPCB Part Class: Extended Part; Datasheet: https://atta.szlcsc.com/upload/public/pdf/source/20200610/C552858_53D2C11F09CDC5A8653CB1835BF580B1.pdf; Supplier: LCSC; Reverse Voltage (Vr): 30V; Average Rectified Current (Io): 1A; Forward Voltage (Vf@If): 560mV@1A
R32 R39 = 0603WAF1000T5E: 电阻类型:厚膜电阻;阻值:100Ω;精度:±1%;功率:100mW;; LCSC Part Name: 100Ω ±1% 100mW; Supplier Part: C22775; Manufacturer: UNI-ROYAL(厚声); Supplier Footprint: 0603; JLCPCB Part Class: Basic Part; Datasheet: https://atta.szlcsc.com/upload/public/pdf/source/20200306/C422600_1E6D84923E4A46A82E41ADD87F860B5C.pdf; Supplier: LCSC; Type: 厚膜电阻; Tolerance: ±1%; Power(Watts): 100mW; Temperature Coefficient: ±200ppm/℃; Overload Voltage (Max): 75V; Operating Temperature Range: -55℃~+155℃
R34 R40 R45 R47 R48 = 0603WAF1001T5E: 电阻类型:厚膜电阻;阻值:1kΩ;精度:±1%;功率:100mW;温度系数:±100ppm/℃;最大工作电压:75V;工作温度范围:-55℃~+155℃;; LCSC Part Name: 1kΩ ±1% 100mW; Supplier Part: C21190; Manufacturer: UNI-ROYAL(厚声); Supplier Footprint: 0603; JLCPCB Part Class: Basic Part; Datasheet: https://atta.szlcsc.com/upload/public/pdf/source/20200306/C422600_1E6D84923E4A46A82E41ADD87F860B5C.pdf; Supplier: LCSC; Type: 厚膜电阻; Tolerance: ±1%; Power(Watts): 100mW; Temperature Coefficient: ±100ppm/℃; Overload Voltage (Max): 75V; Operating Temperature Range: -55℃~+155℃
R36 = AR03BTCX5003N: 电阻类型:薄膜电阻;阻值:500kΩ;精度:±0.1%;功率:100mW;; LCSC Part Name: 500kΩ ±0.1% 100mW; Supplier Part: C2902631; Manufacturer: Viking(光颉); Supplier Footprint: 0603; JLCPCB Part Class: Extended Part; Datasheet: https://atta.szlcsc.com/upload/public/pdf/source/20191129/C465721_10D49275DB41E427863CE9C8D788770A.pdf; Supplier: LCSC; Type: 薄膜电阻; Tolerance: ±0.1%; Power(Watts): 100mW; Temperature Coefficient: ±25ppm/℃; Overload Voltage (Max): 50V; Operating Temperature Range: -55℃~+155℃
R37 = 0603WAF2004T5E: 电阻类型:厚膜电阻;阻值:2MΩ;精度:±1%;功率:100mW;; LCSC Part Name: 2MΩ ±1% 100mW; Supplier Part: C22976; Manufacturer: UNI-ROYAL(厚声); Supplier Footprint: 0603; JLCPCB Part Class: Basic Part; Datasheet: https://atta.szlcsc.com/upload/public/pdf/source/20200306/C422600_1E6D84923E4A46A82E41ADD87F860B5C.pdf; Supplier: LCSC; Type: 厚膜电阻; Tolerance: ±1%; Power(Watts): 100mW; Temperature Coefficient: ±100ppm/℃; Overload Voltage (Max): 75V; Operating Temperature Range: -55℃~+155℃
U4-U6 = RT9013-33GB: 输出类型:固定;输出极性:正;最大输入电压:5.5V;输出电压:3.3V;输出电流:500mA;电源纹波抑制比(PSRR):50dB@(10kHz);; LCSC Part Name: 输入5.5V 输出3.3V 500mA; Supplier Part: C47773; Manufacturer: RICHTEK(立锜); Supplier Footprint: SOT-23-5; JLCPCB Part Class: 扩展库; Datasheet: https://atta.szlcsc.com/upload/public/pdf/source/20150504/1457707282459.pdf; Supplier: LCSC; Output Type: 固定; Output Polarity: 正; Number of Outputs: 1; Maximum Input Voltage: 5.5V; Output Voltage: 3.3V; Dropout Voltage: 400mV@(500mA); Quiescent Current (Ground Current): 50uA; Output Current: 500mA; Power Supply Rejection Ratio (PSRR): 50dB@(10kHz); Operating Temperature: -40℃~+85℃
开关 = TS-1002S-04526C: 触点电流:50mA;额定电压(DC):12V;电路结构:单刀单掷;安装方式:立贴;带灯:-;机械寿命:-;; LCSC Part Name: 6*6*4.5mm 立贴 轻触开关; Supplier Part: C455109; Manufacturer: XUNPU(讯普); Supplier Footprint: SMD,6x6mm; JLCPCB Part Class: 扩展库; Datasheet: https://atta.szlcsc.com/upload/public/pdf/source/20191118/C455109_47445F1146BEE9898FCA1B4091A7258C.pdf; Supplier: LCSC; Contact Current: 50mA; Voltage Rating (DC): 12V; Circuit: 单刀单掷; Mounting Style: 立贴; Actuator Style: 圆形按钮; Switch Length: 6mm; Switch Width: 6mm; Switch Height: 4.5mm
C32 C51 C53 = CL10A106MO8NQNC: 容值:10uF;精度:±20%;额定电压:16V;材质(温度系数):X5R;; LCSC Part Name: 10uF ±20% 16V; Supplier Part: C92487; Manufacturer: SAMSUNG(三星); Supplier Footprint: 0603; JLCPCB Part Class: Extended Part; Datasheet: https://atta.szlcsc.com/upload/public/pdf/source/20221212/2AEE4C8656EA91AC055807CAAFF57F96.pdf; Supplier: LCSC; Tolerance: ±20%; Voltage Rated: 16V; Temperature Coefficient: X5R
C33 C36 C41 C42 = CC0603JRNPO9BN200: 温度系数:NP0;电容体长:-;容值:20pF;电容体宽:-;电容体厚度:-;精度:±5%;额定电压:50V;; LCSC Part Name: 20pF ±5% 50V; Supplier Part: C105621; Manufacturer: YAGEO(国巨); Supplier Footprint: 0603; JLCPCB Part Class: Extended Part; Datasheet: https://atta.szlcsc.com/upload/public/pdf/source/20170425/1493115771885.pdf; Supplier: LCSC; Temperature Coefficient: NP0; Tolerance: ±5%; Voltage Rated: 50V
C39 C43 = CC0603JRNPO9BN150: 容值:15pF;精度:±5%;额定电压:50V;材质(温度系数):NP0;; LCSC Part Name: 15pF ±5% 50V; Supplier Part: C107037; Manufacturer: YAGEO(国巨); Supplier Footprint: 0603; JLCPCB Part Class: Extended Part; Datasheet: https://atta.szlcsc.com/upload/public/pdf/source/20170420/1492670688140.pdf; Supplier: LCSC; Tolerance: ±5%; Voltage Rated: 50V; Temperature Coefficient: NP0
C57 C58 = CL10A105KB8NNNC: 容值:1uF;精度:±10%;额定电压:50V;材质(温度系数):X5R;; LCSC Part Name: 1uF ±10% 50V; Supplier Part: C15849; Manufacturer: SAMSUNG(三星); Supplier Footprint: 0603; JLCPCB Part Class: Basic Part; Datasheet: https://atta.szlcsc.com/upload/public/pdf/source/20160103/1457707679084.pdf; Supplier: LCSC; Tolerance: ±10%; Voltage Rated: 50V; Temperature Coefficient: X5R
D6 = 1N4148W_C2099: 二极管配置:独立式;功率:500mW;直流反向耐压(Vr):100V;平均整流电流(Io):150mA;正向压降(Vf):1.25V@150mA;反向电流(Ir):1uA@75V;反向恢复时间(trr):4ns;工作温度:+150℃@(Tj);; LCSC Part Name: 100V 150mA 4ns T4; Supplier Part: C2099; Manufacturer: CJ(江苏长电/长晶); Supplier Footprint: SOD-123; JLCPCB Part Class: Extended Part; Datasheet: https://atta.szlcsc.com/upload/public/pdf/source/20120428/1457706480199.pdf; Supplier: LCSC; Diode Configuration: 独立式; Power Dissipation: 500mW; Reverse Voltage (Vr): 100V; Average Rectified Current (Io): 150mA; Forward Voltage (Vf@If): 1.25V@150mA; Reverse Leakage Current: 1uA@75V; Reverse Recovery Time (trr): 4ns; Operating Temperature: +150℃@(Tj)
D7-D10 = SMAJ3.3A: 极性:单向;反向截止电压(Vrwm):3.3V;击穿电压:4.2V;反向漏电流(Ir):200uA;峰值脉冲电流(Ipp)@10/1000μs:25A;最大钳位电压:8.3V;; LCSC Part Name: 单向 Vrwm:3.3V; Supplier Part: C2917853; Manufacturer: ZHIDE(志得); Supplier Footprint: SMA; JLCPCB Part Class: Extended Part; Datasheet: https://atta.szlcsc.com/upload/public/pdf/source/20211123/CCA4B0E600B5A566CDC39785DC4CF110.pdf; Supplier: LCSC; Polarity: 单向; Reverse Stand-Off Voltage (Vrwm): 3.3V; Breakdown Voltage: 4.2V; Reverse Leakage Current (Ir): 200uA; Peak Pulse Current (Ipp)@10/1000μs: 25A; Maximum Clamping Voltage: 8.3V
E1-E10 = CESDBLC5V0D3: 极性:双向;反向截止电压(Vrwm):5V;击穿电压(VBR):5.8V;峰值脉冲电流(Ipp)@8/20us:5A;钳位电压(Vc)@Ipp:10V;; Supplier Part: C47346; Manufacturer: CJ(江苏长电/长晶); Supplier Footprint: SOD-323; JLCPCB Part Class: Extended Part; Datasheet: https://atta.szlcsc.com/upload/public/pdf/source/20150504/1457707281364.pdf; Supplier: LCSC; Polarity: 双向; Reverse Stand-Off Voltage (Vrwm): 5V; Breakdown Voltage (VBR): 5.8V; Peak Pulse Current(Ipp)@8/20us: 5A; Clamping Voltage@Ipp: 10V
H4 = 2.54-1*4P反弯排针: 排数:单排;总PIN位数:4;间距:2.54mm;插针结构:1x4P;行距:-;安装类型:弯插;圆针/方针:方针;额定电流:3A;额定电压:-;配合针长度:6mm;塑高:-;端接针长度:-;触头材质:-;触头镀层:-;工作温度范围:-55℃~+105℃;颜色:黑色;; LCSC Part Name: 2.54mm 1x4P 弯插 方针 托盘; Supplier Part: C91552; Manufacturer: BOOMELE(博穆精密); Supplier Footprint: 弯插,P=2.54mm; JLCPCB Part Class: Extended Part; Datasheet: https://atta.szlcsc.com/upload/public/pdf/source/20190508/C74252_03DDEC4696EE17172E44B96636392962.pdf; Supplier: LCSC; Number of Rows: 单排; Number of Pins: 4; Pitch: 2.54mm; Pin Structure: 1x4P; Mounting Type: 弯插; Circluar Pins/Square Pins: 方针; Current Rating (Max): 3A; Length of Mating Pin: 6mm; Operating Temperature Range: -55℃~+105℃; Color: 黑色
I1 T1 = 2.54-1*8P母环保: 排数:单排;总孔位数:8;间距:2.54mm;插孔结构:1x8P;行距:-;安装类型:直插;塑高:-;触头材质:-;触头镀层:-;; LCSC Part Name: 2.54mm 1x8P; Supplier Part: C27438; Manufacturer: BOOMELE(博穆精密); Supplier Footprint: 插件,P=2.54mm; JLCPCB Part Class: Extended Part; Datasheet: https://atta.szlcsc.com/upload/public/pdf/source/20151109/1457707554453.pdf; Supplier: LCSC; Number of Rows: 单排; Number of Holes: 8; Pitch: 2.54mm; Holes Structure: 1x8P; Mounting Type: 直插
K1-K6 = GT-TC060A-H025-L1: 开关长度:6.05mm;开关宽度:3.5mm;开关高度:2.5mm;; LCSC Part Name: 3x6 两脚立式轻触开关 H2.5mm 160gf; Supplier Part: C5117870; Manufacturer: G-Switch(品赞); Supplier Footprint: SMD; JLCPCB Part Class: Extended Part; Datasheet: https://atta.szlcsc.com/upload/public/pdf/source/20220727/66542626AE211ABCA7EA42BB18BFEDDD.pdf; Supplier: LCSC; Switch Length: 6.05mm; Switch Width: 3.5mm; Switch Height: 2.5mm
Krest = TS-1101-C-W: 触点电流:50mA;额定电压(AC):-;额定电压(DC):12V;额定功率:-;绝缘电阻:-;电路结构:单刀单掷;安装方式:立贴;带灯:无;作用力:260gf;机械寿命:5万次;带支架:否;; LCSC Part Name: 立贴 6*3.6*2.5mm 轻触开关 一型3*6*2.5有白ZD b拉伸白色带淡绿按键 卷装; Supplier Part: C318938; Manufacturer: XKB Connectivity(中国星坤); Supplier Footprint: SMD; JLCPCB Part Class: 扩展库; Datasheet: https://atta.szlcsc.com/upload/public/pdf/source/20200227/C318938_C2E53B1EEDE37D980A33616AC086DE53.pdf; Supplier: LCSC; Contact Current: 50mA; Voltage Rating (DC): 12V; Circuit: 单刀单掷; Mounting Style: 立贴; Actuator Style: 矩形按钮; Actuator/Cap Color: 白色带淡绿; With Lamp: 无; Operating Force: 260gf; Mechanical Life: 5万次; Operating Temperature: -30℃~+85℃; Switch Length: 6mm; Switch Width: 3.6mm; Switch Height: 2.5mm; Strike Gundam: 否
LED6 = XL-2012RGBC: 发光颜色:RGB三色;二极管配置:-;主波长:619nm~624nm；463nm~466nm；524nm~527nm;色温:-;功率:80mW；80mW；55mW;安装方式:正贴;; LCSC Part Name: RGB三色 正贴; Supplier Part: C965848; Manufacturer: XINGLIGHT(成兴光); Supplier Footprint: 0805; JLCPCB Part Class: Extended Part; Datasheet: https://atta.szlcsc.com/upload/public/pdf/source/20221102/35E310354F68AE1BCFC07B93F5E395D6.pdf; Supplier: LCSC; Emitted Color: RGB; Lens Color: 无色透明; Dominant Wavelength: 619nm~624nm；463nm~466nm；524nm~527nm; Peak Wavelength: 624nm；528nm；469nm; Forward Current: 25mA; Power Dissipation: 80mW；80mW；55mW; Viewing Angle: 120°; Mounting Sytle: 正贴; Operating Temperature: -30℃~+85℃
LED7-LED10 = NCD0805G1: 翠绿; LCSC Part Name: 翠绿 0805翠绿  正贴; Supplier Part: C84260; Manufacturer: 国星光电; Supplier Footprint: 0805; JLCPCB Part Class: 扩展库; Datasheet: https://atta.szlcsc.com/upload/public/pdf/source/20200820/C84260_AFC7BF57C6FBA034D182BB8D10A67EFE.pdf; Supplier: LCSC; Emitted Color: 翠绿
MCU1 = STM32F103RCT6: CPU内核:ARM Cortex-M3;CPU最大主频:72MHz;工作电压范围:2V~3.6V;内部振荡器:有;程序 FLASH容量:256K@x8bit;RAM总容量:48KB;EEPROM/数据 FLASH容量:-;GPIO端口数量:51;ADC(单元数/通道数/位数):1@x16ch/12bit;DAC(单元数/通道数/位数):1@x2ch/12bit;外设/功能/协议栈:温度传感器；DMA；看门狗；POR；PWM;工作温度范围:-40℃~+85℃;; LCSC Part Name: ARM Cortex-M3 72MHz 闪存：256K@x8bit RAM：48KB; Supplier Part: C8323; Manufacturer: ST(意法半导体); Supplier Footprint: LQFP-64(10x10); JLCPCB Part Class: Extended Part; Datasheet: https://atta.szlcsc.com/upload/public/pdf/source/20161130/1480498797345.pdf; Supplier: LCSC; CPU Core: ARM Cortex-M3; Maximum Frequency: 72MHz; Supply Voltage Range: 2V~3.6V; Internal Oscillator: 有; Program FLASH Size: 256K@x8bit; RAM Size: 48KB; GPIO Ports Number: 51; ADC (Units/Channels/bits): 1@x16ch/12bit; DAC (Units/Channels/bits): 1@x2ch/12bit; Peripherals / Functions / Protocol Stacks: 温度传感器；DMA；看门狗；POR；PWM; Operating Temperature Range: -40℃~+85℃
Q8 = S8550_C2688230: 晶体管类型:PNP;集射极击穿电压(Vceo):25V;集电极电流(Ic):800mA;功率(Pd):350mW;集电极-发射极饱和电压(VCE(sat)@Ic,Ib):600mV@500mA,50mA;直流电流增益(hFE@Ic,Vce):200@50mA,1V;特征频率(fT):150MHz;工作温度:+150℃@(Tj);; Supplier Part: C2688230; Manufacturer: WPMtek(维攀微); Supplier Footprint: SOT-23; JLCPCB Part Class: Extended Part; Datasheet: https://atta.szlcsc.com/upload/public/pdf/source/20210222/C2688230_8573BB53F624B7D8267760DD510E2482.pdf; Supplier: LCSC; Transistor Type: PNP; Collector-Emitter Breakdown Voltage (Vceo): 25V; Collector Current (Ic): 800mA; Power Dissipation (Pd): 350mW; Collector-Emitter Saturation Voltage (VCE(sat)@Ic,Ib): 600mV@500mA,50mA; DC Current Gain (hFE@Ic,Vce): 200@50mA,1V; Transition Frequency (fT): 150MHz; Operating Temperature: +150℃@(Tj)
R44 R46 R49 R73 R74 R76 R77 = 0603WAF1002T5E: 电阻类型:厚膜电阻;阻值:10kΩ;精度:±1%;功率:100mW;温度系数:±100ppm/℃;最大工作电压:75V;工作温度范围:-55℃~+155℃;; LCSC Part Name: 10kΩ ±1% 100mW; Supplier Part: C25804; Manufacturer: UNI-ROYAL(厚声); Supplier Footprint: 0603; JLCPCB Part Class: Basic Part; Datasheet: https://atta.szlcsc.com/upload/public/pdf/source/20200306/C422600_1E6D84923E4A46A82E41ADD87F860B5C.pdf; Supplier: LCSC; Type: 厚膜电阻; Tolerance: ±1%; Power(Watts): 100mW; Temperature Coefficient: ±100ppm/℃; Overload Voltage (Max): 75V; Operating Temperature Range: -55℃~+155℃
R50-R55 R69-R72 = 0603WAF220JT5E: 电阻类型:厚膜电阻;阻值:22Ω;精度:±1%;功率:100mW;温度系数:±100ppm/℃;最大工作电压:75V;工作温度范围:-55℃~+155℃;; LCSC Part Name: 22Ω ±1% 100mW; Supplier Part: C23345; Manufacturer: UNI-ROYAL(厚声); Supplier Footprint: 0603; JLCPCB Part Class: Basic Part; Datasheet: https://atta.szlcsc.com/upload/public/pdf/source/20200306/C422600_1E6D84923E4A46A82E41ADD87F860B5C.pdf; Supplier: LCSC; Type: 厚膜电阻; Tolerance: ±1%; Power(Watts): 100mW; Temperature Coefficient: ±100ppm/℃; Overload Voltage (Max): 75V; Operating Temperature Range: -55℃~+155℃
R56-R62 = 0603WAF3301T5E: 电阻类型:厚膜电阻;阻值:3.3kΩ;精度:±1%;功率:100mW;温度系数:±100ppm/℃;; LCSC Part Name: 厚膜电阻 3.3kΩ ±1% 100mW; Supplier Part: C22978; Manufacturer: UNI-ROYAL(厚声); Supplier Footprint: 0603; JLCPCB Part Class: Basic Part; Datasheet: https://atta.szlcsc.com/upload/public/pdf/source/20200306/C422600_1E6D84923E4A46A82E41ADD87F860B5C.pdf; Supplier: LCSC; Type: 厚膜电阻; Tolerance: ±1%; Power(Watts): 100mW; Temperature Coefficient: ±100ppm/℃; Overload Voltage (Max): 75V; Operating Temperature Range: -55℃~+155℃
R63-R68 = RC0603FR-074K7L: 阻值:4.7kΩ;精度:±1%;功率:100mW;温度系数:±100ppm/℃;最大工作电压:75V;工作温度范围:-55℃~+155℃;; LCSC Part Name: 4.7kΩ ±1% 100mW; Supplier Part: C99782; Manufacturer: YAGEO(国巨); Supplier Footprint: 0603; JLCPCB Part Class: Extended Part; Datasheet: https://atta.szlcsc.com/upload/public/pdf/source/20171030/C99782_15093665213961068236.pdf; Supplier: LCSC; Tolerance: ±1%; Power(Watts): 100mW; Temperature Coefficient: ±100ppm/℃; Overload Voltage (Max): 75V; Operating Temperature Range: -55℃~+155℃
R75 R79 = RS-03K104JT: 阻值:100kΩ;精度:±5%;功率:100mW;温度系数:±100ppm/℃;最大工作电压:50V;工作温度范围:-55℃~+155℃;; LCSC Part Name: 100kΩ ±5% 100mW; Supplier Part: C73806; Manufacturer: FH(风华); Supplier Footprint: 0603; JLCPCB Part Class: Extended Part; Datasheet: https://atta.szlcsc.com/upload/public/pdf/source/20160606/1465200211754.pdf; Supplier: LCSC; Tolerance: ±5%; Power(Watts): 100mW; Temperature Coefficient: ±100ppm/℃; Overload Voltage (Max): 50V; Operating Temperature Range: -55℃~+155℃
R78 = 0603WAF0000T5E: 电阻类型:厚膜电阻;阻值:0Ω;精度:±1%;功率:100mW;; LCSC Part Name: 0Ω ±1% 100mW; Supplier Part: C21189; Manufacturer: UNI-ROYAL(厚声); Supplier Footprint: 0603; JLCPCB Part Class: 基础库; Datasheet: https://atta.szlcsc.com/upload/public/pdf/source/20200306/C422600_1E6D84923E4A46A82E41ADD87F860B5C.pdf; Supplier: LCSC; Type: 厚膜电阻; Tolerance: ±1%; Power(Watts): 100mW; Overload Voltage (Max): 75V; Operating Temperature Range: -55℃~+155℃
TP26-TP29 TP32-TP35 = 螺丝孔: 内径3.0mm，外径4.5mm金属化螺丝孔
U7 = CH340G: 类型:Transceiver;协议类别:USB 2.0;驱动器/接收器数:-;数据速率:2Mbps;; Supplier Part: C14267; Manufacturer: WCH(南京沁恒); Supplier Footprint: SOP-16-150mil; JLCPCB Part Class: Extended Part; Datasheet: https://atta.szlcsc.com/upload/public/pdf/source/20200819/C14267_9F0B4B8160AEBA86F3219E64956E4601.pdf; Supplier: LCSC; Type: Transceiver; Protocol: USB 2.0; Data Rate: 2Mbps; Supply Voltage: 3.3V, 5V
U8 = S8050_C3011093: Supplier Part: C3011093; Manufacturer: JUXING(钜兴); Supplier Footprint: SOT-23; JLCPCB Part Class: Extended Part; Datasheet: https://atta.szlcsc.com/upload/public/pdf/source/20220513/E3925B8FA2E17F54CB5C5AD4F54D9490.pdf; Supplier: LCSC
U9 = PM254-2-04-W-8.5: 排数:双排;总孔位数:8P;间距:2.54mm;插孔结构:2x4P;行距:2.54mm;安装类型:弯插;圆孔/方孔:方孔;额定电流:3A;额定电压:-;插孔方向:侧面;塑高:8.5mm;工作温度范围:-40℃~+105℃;; LCSC Part Name: 间距:2.54mm 2x4P 弯插; Supplier Part: C2897424; Manufacturer: HCTL(华灿天禄); Supplier Footprint: 弯插,P=2.54mm; JLCPCB Part Class: 扩展库; Datasheet: https://atta.szlcsc.com/upload/public/pdf/source/20230609/283C0D22EF4E6FFE03D5A855876981ED.pdf; Supplier: LCSC; Number of Rows: 双排; Number of Holes: 8P; Pitch: 2.54mm; Holes Structure: 2x4P; Row Spacing: 2.54mm; Mounting Type: 弯插; Circular Hole / Square Hole: 方孔; Current Rating (Max): 3A; Holes Direction: 侧面; Insulation Height: 8.5mm; Operating Temperature Range: -40℃~+105℃
X1 = X49SM8MSD2SC: 晶振类型:49SMD;频率:8MHz;频率公差:±20ppm;频率稳定度:±30ppm;负载电容:20pF;工作温度:-20℃~+70℃;; LCSC Part Name: HC-49SMD 8MHz ±20ppm 20pF; Supplier Part: C12674; Manufacturer: YXC(扬兴晶振); Supplier Footprint: HC-49S-SMD-2P; JLCPCB Part Class: Basic Part; Datasheet: https://atta.szlcsc.com/upload/public/pdf/source/20210329/C106809_0E91E60850A780B284B63D653DC40EA4.pdf; Supplier: LCSC; Crystal Type: 49SMD; Frequency Tolerance: ±20ppm; Frequency Stability: ±30ppm; Load Capacitance: 20pF; Operating Temperature: -20℃~+70℃
X2 = X49SM12MSD2SC: 晶振类型:49SMD;频率:12MHz;频率公差:±20ppm;频率稳定度:±30ppm;负载电容:20pF;工作温度:-20℃~+70℃;; LCSC Part Name: HC-49SMD 12MHz ±20ppm 20pF; Supplier Part: C14871; Manufacturer: YXC(扬兴晶振); Supplier Footprint: HC-49S-SMD-2P; JLCPCB Part Class: Extended Part; Datasheet: https://atta.szlcsc.com/upload/public/pdf/source/20210329/C106809_0E91E60850A780B284B63D653DC40EA4.pdf; Supplier: LCSC; Crystal Type: 49SMD; Frequency Tolerance: ±20ppm; Frequency Stability: ±30ppm; Load Capacitance: 20pF; Operating Temperature: -20℃~+70℃
X3 = X206032768KGB2SC: 晶振类型:圆柱体晶振;频率:32.768kHz;频率公差:±10ppm;负载电容:12.5pF;工作温度:-20℃~+70℃;; LCSC Part Name: YT-26 32.768kHz ±10ppm 12.5pF YT-26; Supplier Part: C2236; Manufacturer: YXC(扬兴晶振); Supplier Footprint: DT-26; JLCPCB Part Class: Extended Part; Datasheet: https://atta.szlcsc.com/upload/public/pdf/source/20210329/C13712_F7F11DC87370623B2CDEB0B445E6F76E.pdf; Supplier: LCSC; Crystal Type: 圆柱体晶振; Frequency Tolerance: ±10ppm; Load Capacitance: 12.5pF; Operating Temperature: -20℃~+70℃

## Nets
AGND: AGND.1 C8.2 C9.1 C10.2 L1.1 U3.7(GND)
GND: C1.1 C2.1 C3.2 C4.2 C7.1 C12.1 C17.2 C18.1 C19.1 C20.2 C21.2 C22.1 C23.1 C24.2 C25.2 C26.1 C27.1 C28.2 C29.1 C30.1 C31.2 C32.2 C33.2 C34.2 C35.2 C36.2 C37.1 C38.1 C39.2 C40.1 C41.1 C42.1 C43.2 C44.1 C45.1 C46.1 C47.1 C48.1 C49.1 C50.1 C51.1 C52.1 C53.1 C54.1 C55.1 C56.1 C58.2 CN1.2 D1.2(A) D2.2(A) D7.2(K) D8.2(K) D9.2(K) D10.2(K) E1.2 E2.2 E3.2 E4.2 E5.2 E6.2 E7.2 E8.2 E9.2 E10.2 GND.1 H2.2 H3.2 H4.2 I1.7 K1.1 K2.1 K3.1 K4.1 K5.1 K6.1 Krest.2 L1.2 LED3.1(K) LED4.1(K) LED5.1(K) MCU1.12(VSSA) MCU1.18(VSS_4) MCU1.31(VSS_1) MCU1.47(VSS_2) MCU1.63(VSS_3) Q2.2(S) Q4.2(S) Q7.2(S) Q10.2(S) R1.1 R4.2 R7.1 R21.1 R23.2 R27.1 R39.1 R42.1 R49.1 R74.2 R78.1 R79.2 SW1.3 SW1.(3) SW2.3 SW2.(3) T1.7 TP26.1 TP27.1 TP28.1 TP29.1 TP32.1 TP33.1 TP34.1 TP35.1 U2.3(GND) U2.9(EP) U4.2(GND) U5.2(GND) U6.2(GND) U7.1(GND) U9.4 USB1.0(SHLD) USB1.5(GND) 开关.1
VBAT_SYS: C15.2 C17.1 C18.2 C21.1 C22.2 C28.1 C29.2 Q5.3(D) TP6.1 U4.1(VIN) U4.3(EN) U5.1(VIN) U5.3(EN) U6.1(VIN) U6.3(EN)
VBUS_5V: C3.1 C4.1 C32.1 C34.1 LED1.1(A) LED2.2(A) R2.1 R8.2 U1.2 U2.4(VCC) U7.16(VCC)
VCC_3V3: 3V2.1 C19.2 C20.1 C37.2 C38.2 C53.2 C54.2 C55.2 C56.2 C57.1 D7.1(A) D8.1(A) H4.1 I1.8 LED6.3 LED7.1(A) LED8.1(A) LED9.1(A) LED10.1(A) MCU1.13(VDDA) MCU1.19(VDD_4) MCU1.32(VDD_1) MCU1.48(VDD_2) MCU1.64(VDD_3) Q8.2(E) Q9.2(S) R3.1 R31.2 R33.2 R44.2 R46.2 R63.2 R64.2 R65.2 R66.2 R67.2 R68.2 R75.1 SW1.1 SW1.(1) SW2.1 SW2.(1) U4.5(VOUT)
VCC_3V3_1: 3V3_1.1 C6.1 C11.1 C23.2 C24.1 Q1.2(S) Q3.2(S) R16.2 R24.2 R38.2 U5.5(VOUT)
VCC_3V3_2: 3V1.1 3V3_2.1 C8.1 C9.2 C30.2 C31.1 R22.2 R43.2 U3.6(VDD) U6.5(VOUT)
VCC_TFT: C44.2 C51.2 C52.2 D9.1(A) D10.1(A) Q9.3(D) T1.8 U9.2
-IN: R13.2 R14.1 U3.4(-IN)
BAT: C1.2 C2.2 C13.2 C14.2 C16.2 CN1.1 D1.1(C) Q5.2(S) R18.2 R28.2 R29.2 R30.2 TP1.1 TP5.1 U2.5(BAT)
BAT_00_CTL: MCU1.36(PB15) R59.1
BAT_25_CTL: MCU1.35(PB14) R60.1
BAT_50_CTL: MCU1.34(PB13) R61.1
BAT_75_CTL: MCU1.33(PB12) R62.1
BOOT0: MCU1.60(BOO_T0) R48.2
BOOT1: R73.2 R74.1
CH340_D+: R3.2 U7.5(UD+) USB1.3(D+)
CH340_D-: U7.6(UD-) USB1.2(D-)
CHRG: R9.1 U2.7(CHRG#)
DIAN_LIANG: MCU1.17(PA3) R20.2
I2C2_SCL: I1.6 MCU1.29(PB10) TP16.1
I2C2_SDA: I1.5 MCU1.30(PB11) TP15.1
K1: C45.2 K1.2 MCU1.8(PC0) R63.1
K2: C48.2 K2.2 MCU1.9(PC1) R66.1
K3: C46.2 K3.2 MCU1.10(PC2) R64.1
K4: C49.2 K4.2 MCU1.11(PC3) R67.1
K5: C47.2 K5.2 MCU1.40(PC9) R65.1
K6: C50.2 K6.2 MCU1.39(PC8) R68.1
LEFT_Q: MCU1.15(PA1) R11.1
LEFT_Z: MCU1.16(PA2) R12.1
MOT_L: MCU1.38(PC7) R19.2
MOT_R: MCU1.37(PC6) R26.2
O/F: MCU1.21(PA5) R40.2 TP14.1
ON: MCU1.23(PA7) R35.1 TP7.1
OSC32_IN: C43.1 MCU1.3(PC14-OSC32_IN) X3.1(OSC1)
OSC32_OUT: C39.1 MCU1.4(PC15-OSC32_OUT) X3.2(OSC2)
OSC_IN: C33.1 MCU1.5(PDO-OSC_IN) X1.1(OSC1)
OSC_OUT: C36.1 MCU1.6(PD1-OSC_OUT) X1.2(OSC2)
PB4: E1.1 R53.2 T1.1
PB5: E2.1 R54.2 T1.2
PB6: E3.1 R55.2 T1.3
PB7: E4.1 R52.2 T1.4
PB8: E5.1 R50.2 T1.5
PB9: E6.1 R51.2 T1.6
RESET: C40.2 D6.2(A) Krest.1 MCU1.7(NRST) R46.1
RGB_B_CTL: MCU1.45(PA12) R56.1
RGB_G_CTL: MCU1.44(PA11) R57.1
RGB_R_CTL: MCU1.41(PA8) R58.1
RIGHT_Q: MCU1.24(PC4) R5.1
RIGHT_Z: MCU1.25(PC5) R6.1
STDBY: R10.1 U2.6(STDBY#)
SWCLK: E10.1 H4.4 R71.2
SWDIO: E9.1 H4.3 R72.2
TFT_O/F: MCU1.54(PD2) R77.1
U1_RXD: MCU1.43(PA10) U7.2(TXD)
U1_TXD: MCU1.42(PA9) U7.3(RXD)
VO1: H1.2 R15.1 TP3.1 U3.5(Vo1)
VO2: H1.1 TP2.1 U3.8(Vo2)
WIRE_RX: E7.1 R69.2 U9.6
WIRE_TX: E8.1 R70.2 U9.8
YIN_PIN: C5.2 MCU1.20(PA4) TP4.1
$5N907: LED1.2(K) R9.2
$5N908: LED2.1(K) R10.2
$5N929: R8.1 U2.8(CE)
$5N2125: R1.2 R2.2 R4.1 U2.1(TEMP)
$5N4291: R7.2 U2.2(PROG)
$5N11577: Q2.3(D) R17.1
$5N11579: C6.2 Q1.1(G) R16.1 R17.2
$5N11580: C7.2 Q2.1(G) R19.1 R21.2
$5N11583: H2.1 Q1.3(D)
$5N11956: Q4.3(D) R25.1
$5N11958: C11.2 Q3.1(G) R24.1 R25.2
$5N11959: C12.2 Q4.1(G) R26.1 R27.2
$5N19378: 5V.1 D2.1(K) U1.1 USB1.1(VCC)
$5N20656: C5.1 R13.1
$5N20665: R14.2 R15.2
$5N20971: R22.1 U3.1(nSHUTDOWN)
$5N20975: C10.1 U3.2(BYPASS) U3.3(+IN)
$5N21183: R6.2 SW1.2
$5N21195: R12.2 SW2.2
$5N21197: R11.2 SW2.(2)
$5N33076: H3.1 Q3.3(D)
$5N41643: R5.2 SW1.(2)
$5N43192: R18.1 R20.1 R23.1
$6N1296: D3.2(A) R33.1 R35.2
$6N1659: C16.1 Q5.1(G) R30.1 R32.1 R34.2
$6N1697: C15.1 R32.2
$6N1714: Q7.1(G) R41.2
$6N3138: Q6.3(D) R34.1 R39.2 TP8.1
$6N3145: Q6.1(G) R36.2 R37.2 TP10.1
$6N3151: C26.2 C27.2 R40.1 R41.1 R42.2 TP12.1
$6N3161: D5.2(A) Q6.2(S) Q7.3(D) R29.1 R37.1 TP13.1
$6N3461: C13.1 C14.1 D4.1(C) R36.1 TP9.1
$6N3462: C25.1 D3.1(C) D4.2(A) D5.1(C) R28.1 TP11.1 开关.4
$6N5792: LED3.2(A) R31.1
$6N11808: LED4.2(A) R38.1
$6N20129: LED5.2(A) R43.1
$11N5099: Q8.3(C) R48.1 R49.2
$11N5145: Q8.1(B) R47.2
$11N5258: R47.1 U7.14(RTS#) U8.2(E)
$11N5374: R45.2 U8.1(B)
$11N5440: D6.1(K) R44.1 U8.3(C)
$11N5541: R45.1 U7.13(DTR#)
$11N5796: C41.2 U7.8(XO) X2.2(OSC2)
$11N5816: C42.2 U7.7(XI) X2.1(OSC1)
$11N6066: C35.1 U7.4(V3)
$11N137242: LED6.4 R56.2
$11N137247: LED6.2 R57.2
$11N137250: LED6.1 R58.2
$11N137255: LED7.2(K) R59.2
$11N137258: LED8.2(K) R60.2
$11N137261: LED9.2(K) R61.2
$11N137264: LED10.2(K) R62.2
$11N200218: MCU1.1(VBAT) TP17.1
$11N200223: MCU1.2(PC13-TAMPER-RTC) TP18.1
$11N200225: MCU1.50(PA15) TP22.1
$11N200258: MCU1.52(PC11) R69.1
$11N200263: MCU1.51(PC10) R70.1
$11N200266: MCU1.46(PA13) R72.1
$11N200269: MCU1.49(PA14) R71.1
$11N200276: MCU1.28(PB2) R73.1
$11N200277: MCU1.56(PB4) R53.1
$11N200280: MCU1.57(PB5) R54.1
$11N200283: MCU1.58(PB6) R55.1
$11N200286: MCU1.59(PB7) R52.1
$11N200304: MCU1.22(PA6) TP23.1
$11N200306: MCU1.62(PB9) R51.1
$11N200309: MCU1.61(PB8) R50.1
$11N200560: MCU1.14(PA0-WKUP) TP20.1
$11N200563: MCU1.26(PB0) TP24.1
$11N200566: MCU1.27(PB1) TP25.1
$11N200569: MCU1.55(PB3) TP19.1
$11N200575: MCU1.53(PC12) TP21.1
$11N209253: C57.2 Q9.1(G) R75.2 R76.1 TP30.1
$11N209257: C58.1 Q10.1(G) R77.2 R79.1 TP31.1
$11N209259: Q10.3(D) R76.2 R78.2

Not connected (* = marked no-connect by the designer): I1 1* 2* 3* 4*; R15 3*; U4 4(NC)*; U5 4(NC)*; U6 4(NC)*; U7 9(CTS#)* 10(DSR#)* 11(RI#)* 12(DCD#)* 15(R232)*; U9 1* 3* 5* 7*; USB1 4(ID)*; 开关 2* 3*

## Notes on the sheets
sheet 1
- PASS
- PASS
- PASS
- PASS
- 充电主电路
- 充电电源滤波保护
- USB输入
- 遥杆
- PASS
- 充电显示
- 音频输出
- PASS
- PASS
- 电池电量检测
- 音频输入
- 振动马达
- 音频功放
sheet 2
- Pass
- Pass
- 稳压3V3
- 开关电路
- PASS
- Pass
- Pass
sheet 3
- Pass
- Pass
- OSCILLATOR
- Pass
- SWD
- Pass
- RESET
- Pass
- IMU
- USB_TO_UART
- Address:110100X
  R:X=1
  W:X=0
- Pass
- Pass
- MCU
- Pass
- TFT1.4
- Pass
- LED
- KEY
- Pass
- Pass
- MCU_POWER
- Wireless
- Pass
- Pass
- TFT_O/F
- 板对板结构孔
- IMU结构孔
- 屏幕结构孔
- PASS
